# EAGLE design WS2811_Relais (EAGLE 9.5.2)
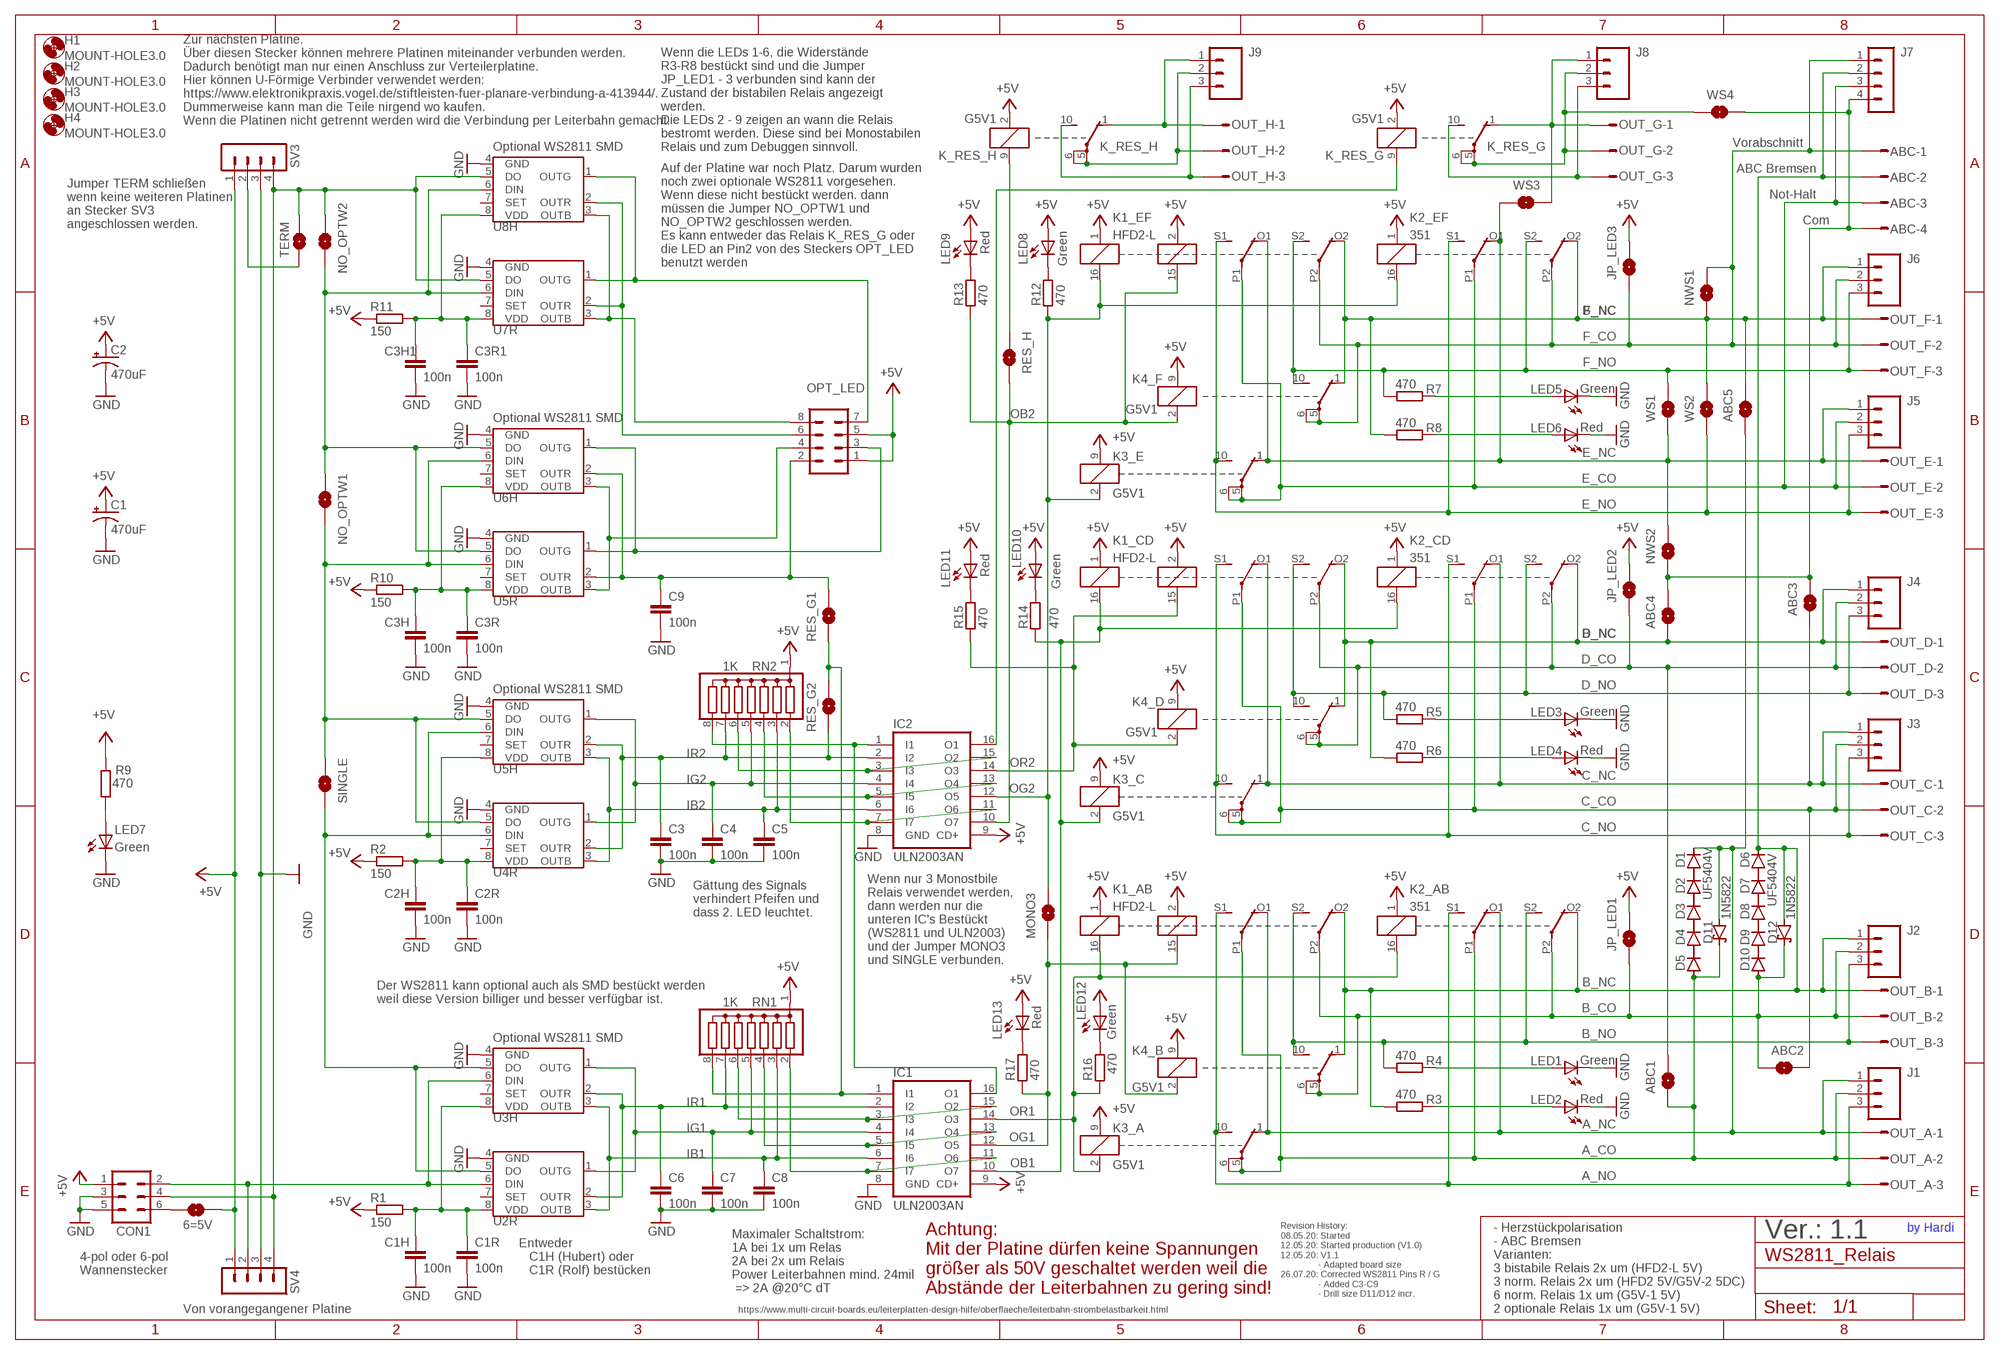
[diagram p0: schematic, sheet 1]

## Parts
6=5V  SOLDERJUMPERNO  [SJ_2S-NO]
ABC  STL1550-4ON_BOARD  [STL1550-4_ON_BOARD]
ABC1  SOLDERJUMPERNO  [SJ_2S-NO]
ABC2  SOLDERJUMPERNO  [SJ_2S-NO]
ABC3  SOLDERJUMPERNO  [SJ_2S-NO]
ABC4  SOLDERJUMPERNO  [SJ_2S-NO]
ABC5  SOLDERJUMPERNO  [SJ_2S-NO]
C1  470uF  SPARKFUN-CAPACITORS_100UF-25V-20%(PTH)  [SPARKFUN-CAPACITORS_CPOL-RADIAL-100UF-25V]
C1H  100n  C-EUC1206  [C1206]
C1R  100n  C-EU025-024X044  [C025-024X044]
C2  470uF  SPARKFUN-CAPACITORS_100UF-25V-20%(PTH)  [SPARKFUN-CAPACITORS_CPOL-RADIAL-100UF-25V]
C2H  100n  C-EUC1206  [C1206]
C2R  100n  C-EU025-024X044  [C025-024X044]
C3  100n  C-EU025-024X044  [C025-024X044]
C3H  100n  C-EUC1206  [C1206]
C3H1  100n  C-EUC1206  [C1206]
C3R  100n  C-EU025-024X044  [C025-024X044]
C3R1  100n  C-EU025-024X044  [C025-024X044]
C4  100n  C-EU025-024X044  [C025-024X044]
C5  100n  C-EU025-024X044  [C025-024X044]
C6  100n  C-EU025-024X044  [C025-024X044]
C7  100n  C-EU025-024X044  [C025-024X044]
C8  100n  C-EU025-024X044  [C025-024X044]
C9  100n  C-EU025-024X044  [C025-024X044]
CON1  ML6  [ML6]
D1  UF5404V  [DO201-15-V]
D2  UF5404V  [DO201-15-V]
D3  UF5404V  [DO201-15-V]
D4  UF5404V  [DO201-15-V]
D5  UF5404V  [DO201-15-V]
D6  UF5404V  [DO201-15-V]
D7  UF5404V  [DO201-15-V]
D8  UF5404V  [DO201-15-V]
D9  UF5404V  [DO201-15-V]
D10  UF5404V  [DO201-15-V]
D11  1N5822  [DO41-7.6]
D12  1N5822  [DO41-7.6]
H1  MOUNT-HOLE3.0  [3,0]
H2  MOUNT-HOLE3.0  [3,0]
H3  MOUNT-HOLE3.0  [3,0]
H4  MOUNT-HOLE3.0  [3,0]
IC1  ULN2003AN  [DIL16]
IC2  ULN2003AN  [DIL16]
J1  M03PTH  [1X03]
J2  M03PTH  [1X03]
J3  M03PTH  [1X03]
J4  M03PTH  [1X03]
J5  M03PTH  [1X03]
J6  M03PTH  [1X03]
J7  MA04-1  [MA04-1]
J8  M03PTH  [1X03]
J9  M03PTH  [1X03]
JP_LED1  SOLDERJUMPERNO  [SJ_2S-NO]
JP_LED2  SOLDERJUMPERNO  [SJ_2S-NO]
JP_LED3  SOLDERJUMPERNO  [SJ_2S-NO]
K1_AB  HFD2-L  [HFD2-L]
K1_CD  HFD2-L  [HFD2-L]
K1_EF  HFD2-L  [HFD2-L]
K2_AB  351  [351]
K2_CD  351  [351]
K2_EF  351  [351]
K3_A  G5V1  [G5V1]
K3_C  G5V1  [G5V1]
K3_E  G5V1  [G5V1]
K4_B  G5V1  [G5V1]
K4_D  G5V1  [G5V1]
K4_F  G5V1  [G5V1]
K_RES_G  G5V1  [G5V1]
K_RES_H  G5V1  [G5V1]
LED1  Green  LED3MM  [LED3MM]
LED2  Red  LED3MM  [LED3MM]
LED3  Green  LED3MM  [LED3MM]
LED4  Red  LED3MM  [LED3MM]
LED5  Green  LED3MM  [LED3MM]
LED6  Red  LED3MM  [LED3MM]
LED7  Green  LED3MM  [LED3MM]
LED8  Green  LED3MM  [LED3MM]
LED9  Red  LED3MM  [LED3MM]
LED10  Green  LED3MM  [LED3MM]
LED11  Red  LED3MM  [LED3MM]
LED12  Green  LED3MM  [LED3MM]
LED13  Red  LED3MM  [LED3MM]
MONO3  SOLDERJUMPERNO  [SJ_2S-NO]
NO_OPTW1  SOLDERJUMPERNO  [SJ_2S-NO]
NO_OPTW2  SOLDERJUMPERNO  [SJ_2S-NO]
NWS1  SOLDERJUMPERNO  [SJ_2S-NO]
NWS2  SOLDERJUMPERNO  [SJ_2S-NO]
OPT_LED  CON-HARTING-ML_ML08  [CON-HARTING-ML_ML08]
OUT_A  STL1550-3  [STL1550-3]
OUT_B  STL1550-3  [STL1550-3]
OUT_C  STL1550-3  [STL1550-3]
OUT_D  STL1550-3  [STL1550-3]
OUT_E  STL1550-3  [STL1550-3]
OUT_F  STL1550-3  [STL1550-3]
OUT_G  STL1550-3  [STL1550-3]
OUT_H  STL1550-3  [STL1550-3]
R1  150  RCL_R-EU_0207/2V  [RCL_0207/2V]
R2  150  RCL_R-EU_0207/2V  [RCL_0207/2V]
R3  470  R0204/2V  [0204/2V]
R4  470  R0204/2V  [0204/2V]
R5  470  R0204/2V  [0204/2V]
R6  470  R0204/2V  [0204/2V]
R7  470  R0204/2V  [0204/2V]
R8  470  R0204/2V  [0204/2V]
R9  470  R0204/2V  [0204/2V]
R10  150  RCL_R-EU_0207/2V  [RCL_0207/2V]
R11  150  RCL_R-EU_0207/2V  [RCL_0207/2V]
R12  470  R0204/2V  [0204/2V]
R13  470  R0204/2V  [0204/2V]
R14  470  R0204/2V  [0204/2V]
R15  470  R0204/2V  [0204/2V]
R16  470  R0204/2V  [0204/2V]
R17  470  R0204/2V  [0204/2V]
RES_G1  SOLDERJUMPERNO  [SJ_2S-NO]
RES_G2  SOLDERJUMPERNO  [SJ_2S-NO]
RES_H  SOLDERJUMPERNO  [SJ_2S-NO]
RN1  1K  G07R  [SIL8]
RN2  1K  G07R  [SIL8]
SINGLE  SOLDERJUMPERNO  [SJ_2S-NO]
SV3  MA04-1  [MA04-1]
SV4  MA04-1  [MA04-1]
TERM  SOLDERJUMPERNO  [SJ_2S-NO]
U2R  TINY45-20-DIP  S3PO_MODUL_WS2811_SOUND_MP3-TF-16P_WS2811_AND_ATTINY_WS2811-ICTINY45-20-DIP  [S3PO_MODUL_WS2811_SOUND_MP3-TF-16P_WS2811_AND_ATTINY_WS2811_DIP08]
U3H  WS2811 SOT-8  S3PO_MODUL_WS2811_SOUND_MP3-TF-16P_WS2811_AND_ATTINY_WS2811-ICSOP8  [SOP8]
U4R  TINY45-20-DIP  S3PO_MODUL_WS2811_SOUND_MP3-TF-16P_WS2811_AND_ATTINY_WS2811-ICTINY45-20-DIP  [S3PO_MODUL_WS2811_SOUND_MP3-TF-16P_WS2811_AND_ATTINY_WS2811_DIP08]
U5H  WS2811 SOT-8  S3PO_MODUL_WS2811_SOUND_MP3-TF-16P_WS2811_AND_ATTINY_WS2811-ICSOP8  [SOP8]
U5R  TINY45-20-DIP  S3PO_MODUL_WS2811_SOUND_MP3-TF-16P_WS2811_AND_ATTINY_WS2811-ICTINY45-20-DIP  [S3PO_MODUL_WS2811_SOUND_MP3-TF-16P_WS2811_AND_ATTINY_WS2811_DIP08]
U6H  WS2811 SOT-8  S3PO_MODUL_WS2811_SOUND_MP3-TF-16P_WS2811_AND_ATTINY_WS2811-ICSOP8  [SOP8]
U7R  TINY45-20-DIP  S3PO_MODUL_WS2811_SOUND_MP3-TF-16P_WS2811_AND_ATTINY_WS2811-ICTINY45-20-DIP  [S3PO_MODUL_WS2811_SOUND_MP3-TF-16P_WS2811_AND_ATTINY_WS2811_DIP08]
U8H  WS2811 SOT-8  S3PO_MODUL_WS2811_SOUND_MP3-TF-16P_WS2811_AND_ATTINY_WS2811-ICSOP8  [SOP8]
WS1  SOLDERJUMPERNO  [SJ_2S-NO]
WS2  SOLDERJUMPERNO  [SJ_2S-NO]
WS3  SOLDERJUMPERNO  [SJ_2S-NO]
WS4  SOLDERJUMPERNO  [SJ_2S-NO]

## Nets
$N100: IC2.7(I7) IC2.11(O6) RN2.2
+5V: 6=5V.2 C1.1(+) C2.1(+) CON1.1 IC1.9(CD+) IC2.9(CD+) JP_LED1.2 JP_LED2.2 JP_LED3.2 K1_AB.1 K1_AB.2 K1_CD.1 K1_CD.2 K1_EF.1 K1_EF.2 K2_AB.1 K2_CD.1 K2_EF.1 K3_A.9 K3_C.9 K3_E.9 K4_B.9 K4_D.9 K4_F.9 K_RES_G.2 K_RES_H.2 LED8.A LED9.A LED10.A LED11.A LED12.A LED13.A OPT_LED.1 OPT_LED.5 R1.1 R2.1 R9.1 R10.1 R11.1 RN1.1 RN2.1 SV3.1 SV4.1
A_CO: ABC1.1 D5.A D11.C J1.2 K1_AB.P1(2:P) K2_AB.P1(2:P) K3_A.5(2:P) K3_A.6(2:P) OUT_A.2
A_NC: ABC5.2 D1.C D11.A J1.1 K1_AB.O1(2:O) K2_AB.O1(2:O) K3_A.1(2:O) OUT_A.1
A_NO: J1.3 K1_AB.S1(2:S) K2_AB.S1(2:S) K3_A.10(2:S) OUT_A.3
B_CO: ABC2.1 D10.A D12.C J2.2 JP_LED1.1 K1_AB.P2(3:P) K2_AB.P2(3:P) K4_B.5(2:P) K4_B.6(2:P) OUT_B.2
B_NC: ABC.2 D6.C D12.A J2.1 J7.2 K1_AB.O2(3:O) K2_AB.O2(3:O) K4_B.1(2:O) OUT_B.1 R3.2
B_NO: J2.3 K1_AB.S2(3:S) K2_AB.S2(3:S) K4_B.10(2:S) OUT_B.3 R4.2
C_CO: ABC2.2 J3.2 K1_CD.P1(2:P) K2_CD.P1(2:P) K3_C.5(2:P) K3_C.6(2:P) OUT_C.2
C_NC: ABC3.2 J3.1 K1_CD.O1(2:O) K2_CD.O1(2:O) K3_C.1(2:O) OUT_C.1
C_NO: J3.3 K1_CD.S1(2:S) K2_CD.S1(2:S) K3_C.10(2:S) OUT_C.3
D_CO: ABC1.2 J4.2 JP_LED2.1 K1_CD.P2(3:P) K2_CD.P2(3:P) K4_D.5(2:P) K4_D.6(2:P) OUT_D.2
D_NC: ABC4.2 J4.1 K1_CD.O2(3:O) K2_CD.O2(3:O) K4_D.1(2:O) OUT_D.1 R6.2
D_NO: J4.3 K1_CD.S2(3:S) K2_CD.S2(3:S) K4_D.10(2:S) OUT_D.3 R5.2
E_CO: ABC.3 J5.2 J7.3 K1_EF.P1(2:P) K2_EF.P1(2:P) K3_E.5(2:P) K3_E.6(2:P) OUT_E.2
E_NC: J5.1 K1_EF.O1(2:O) K2_EF.O1(2:O) K3_E.1(2:O) NWS2.1 OUT_E.1 WS1.2 WS3.2
E_NO: J5.3 K1_EF.S1(2:S) K2_EF.S1(2:S) K3_E.10(2:S) OUT_E.3 WS2.2
F_CO: ABC.1 J6.2 J7.1 JP_LED3.1 K1_EF.P2(3:P) K2_EF.P2(3:P) K4_F.5(2:P) K4_F.6(2:P) NWS1.1 OUT_F.2
F_NC: ABC5.1 J6.1 K1_EF.O2(3:O) K2_EF.O2(3:O) K4_F.1(2:O) NWS1.2 OUT_F.1 R8.2 WS2.1
F_NO: J6.3 K1_EF.S2(3:S) K2_EF.S2(3:S) K4_F.10(2:S) OUT_F.3 R7.2 WS1.1
GND: C1.2(-) C1H.2 C1R.2 C2.2(-) C2H.2 C2R.2 C3.2 C3H1.2 C3H.2 C3R1.2 C3R.2 C4.2 C5.2 C6.2 C7.2 C8.2 C9.2 CON1.3 CON1.5 IC1.8(GND) IC2.8(GND) LED1.K(C) LED2.K(C) LED3.K(C) LED4.K(C) LED5.K(C) LED6.K(C) LED7.K(C) SV3.3 SV4.3 U2R.4(GND) U3H.4(GND) U4R.4(GND) U5H.4(GND) U5R.4(GND) U6H.4(GND) U7R.4(GND) U8H.4(GND)
IB1: C8.1 IC1.6(I6) RN1.3 U2R.3(OUTB) U3H.3(OUTB)
IB2: C5.1 IC2.6(I6) RN2.3 U4R.3(OUTB) U5H.3(OUTB)
IB3: OPT_LED.4 U5R.3(OUTB) U6H.3(OUTB)
IB4: OPT_LED.8 U7R.3(OUTB) U8H.3(OUTB)
IG1: C7.1 IC1.4(I4) RN1.5 U2R.1(OUTG) U3H.1(OUTG)
IG2: C4.1 IC2.4(I4) RN2.5 U4R.1(OUTG) U5H.1(OUTG)
IG3: OPT_LED.3 U5R.1(OUTG) U6H.1(OUTG)
IG4: OPT_LED.7 U7R.1(OUTG) U8H.1(OUTG)
IR1: C6.1 IC1.2(I2) RN1.7 U2R.2(OUTR) U3H.2(OUTR)
IR2: C3.1 IC2.2(I2) RES_G2.2 RN2.7 U4R.2(OUTR) U5H.2(OUTR)
IR3: IC1.1(I1) RES_G1.2 RES_G2.1 RN1.8
IR4: OPT_LED.6 U7R.2(OUTR) U8H.2(OUTR)
N$1: CON1.2 SV4.2 U2R.6(DIN) U3H.6(DIN)
N$2: LED2.A R3.1
N$3: CON1.4 NO_OPTW2.1 SV3.4 SV4.4 TERM.1 U7R.5(DO) U8H.5(DO)
N$4: C1H.1 C1R.1 R1.2 U2R.8(VDD) U3H.8(VDD)
N$5: LED1.A R4.1
N$6: 6=5V.1 CON1.6
N$7: IC1.7(I7) IC1.11(O6) RN1.2
N$8: LED4.A R6.1
N$9: IC1.3(I3) IC1.15(O2) RN1.6
N$10: SV3.2 TERM.2
N$11: IC1.5(I5) IC1.13(O4) RN1.4
N$12: LED3.A R5.1
N$13: C2H.1 C2R.1 R2.2 U4R.8(VDD) U5H.8(VDD)
N$14: LED6.A R8.1
N$15: LED5.A R7.1
N$16: D1.A D2.C
N$17: IC1.16(O1) IC2.1(I1) RN2.8
N$18: IC2.5(I5) IC2.13(O4) RN2.4
N$19: D2.A D3.C
N$20: SINGLE.2 U2R.5(DO) U3H.5(DO) U4R.6(DIN) U5H.6(DIN)
N$21: D3.A D4.C
N$22: LED7.A R9.2
N$23: D4.A D5.C
N$24: D7.A D8.C
N$25: D8.A D9.C
N$26: D9.A D10.C
N$27: D6.A D7.C
N$28: C9.1 OPT_LED.2 RES_G1.1 U5R.2(OUTR) U6H.2(OUTR)
N$29: IC2.3(I3) IC2.15(O2) RN2.6
N$30: J8.2 K_RES_G.5(2:P) K_RES_G.6(2:P) OUT_G.2 WS4.2
N$31: IC2.16(O1) K_RES_G.9
N$32: J8.1 K_RES_G.1(2:O) OUT_G.1 WS3.1
N$33: J8.3 K_RES_G.10(2:S) OUT_G.3
N$34: NO_OPTW1.1 NO_OPTW2.2 U5R.5(DO) U6H.5(DO) U7R.6(DIN) U8H.6(DIN)
N$35: C3H.1 C3R.1 R10.2 U5R.8(VDD) U6H.8(VDD)
N$36: J9.2 K_RES_H.5(2:P) K_RES_H.6(2:P) OUT_H.2
N$37: NO_OPTW1.2 SINGLE.1 U4R.5(DO) U5H.5(DO) U5R.6(DIN) U6H.6(DIN)
N$38: J9.3 K_RES_H.10(2:S) OUT_H.3
N$39: C3H1.1 C3R1.1 R11.2 U7R.8(VDD) U8H.8(VDD)
N$40: J9.1 K_RES_H.1(2:O) OUT_H.1
N$41: K_RES_H.9 RES_H.2
N$42: LED8.K(C) R12.1
N$43: LED9.K(C) R13.1
N$44: LED10.K(C) R14.1
N$45: LED11.K(C) R15.1
N$46: LED12.K(C) R16.1
N$47: LED13.K(C) R17.1
N$49: ABC3.1 ABC4.1 ABC.4 J7.4 NWS2.2 WS4.1
OB1: IC1.10(O7) K1_CD.16 K2_CD.16 K3_C.2 R14.2
OB2: IC2.10(O7) K1_EF.15 K4_F.2 R13.2 RES_H.1
OG1: IC1.12(O5) K1_AB.15 K4_B.2 MONO3.2 R17.2
OG2: IC2.12(O5) K1_EF.16 K2_EF.16 K3_E.2 MONO3.1 R12.2
OR1: IC1.14(O3) K1_AB.16 K2_AB.16 K3_A.2 R16.2
OR2: IC2.14(O3) K1_CD.15 K4_D.2 R15.2
Unconnected: U2R.7(SET) U3H.7(SET) U4R.7(SET) U5H.7(SET) U5R.7(SET) U6H.7(SET) U7R.7(SET) U8H.7(SET)

## Notes on the sheet
- Wenn die LEDs 1-6, die Widerstände
  R3-R8 bestückt sind und die Jumper 
  JP_LED1 - 3 verbunden sind kann der 
  Zustand der bistabilen Relais angezeigt
  werden. 
  Die LEDs 2 - 9 zeigen an wann die Relais
  bestromt werden. Diese sind bei Monostabilen
  Relais und zum Debuggen sinnvoll.
- Zur nächsten Platine. 
  Über diesen Stecker können mehrere Platinen miteinander verbunden werden.
  Dadurch benötigt man nur einen Anschluss zur Verteilerplatine.
  Hier können U-Förmige Verbinder verwendet werden: 
  https://www.elektronikpraxis.vogel.de/stiftleisten-fuer-planare-verbindung-a-413944/.
  Dummerweise kann man die Teile nirgend wo kaufen.
  Wenn die Platinen nicht getrennt werden wird die Verbindung per Leiterbahn gemacht.
- Vorabschnitt
- Optional WS2811 SMD
- ABC Bremsen
- Not-Halt
- Com
- Jumper TERM schließen 
  wenn keine weiteren Platinen
  an Stecker SV3 
  angeschlossen werden.
- Auf der Platine war noch Platz. Darum wurden
  noch zwei optionale WS2811 vorgesehen. 
  Wenn diese nicht bestückt werden. dann 
  müssen die Jumper NO_OPTW1 und 
  NO_OPTW2 geschlossen werden. 
  Es kann entweder das Relais K_RES_G oder 
  die LED an Pin2 von des Steckers OPT_LED 
  benutzt werden
- Optional WS2811 SMD
- Optional WS2811 SMD
- Gättung des Signals
  verhindert Pfeifen und
  dass 2. LED leuchtet.
- Wenn nur 3 Monostbile
  Relais verwendet werden,
  dann werden nur die
  unteren IC's Bestückt
  (WS2811 und ULN2003)
  und der Jumper MONO3
  und SINGLE verbunden.
- Der WS2811 kann optional auch als SMD bestückt werden
  weil diese Version billiger und besser verfügbar ist.
- Optional WS2811 SMD
- Ver.: 1.1
- Achtung:
  Mit der Platine dürfen keine Spannungen
  größer als 50V geschaltet werden weil die
  Abstände der Leiterbahnen zu gering sind!
- Revision History:
  08.05.20: Started
  12.05.20: Started production (V1.0)
  12.05.20: V1.1
                 - Adapted board size
  26.07.20: Corrected WS2811 Pins R / G
                 - Added C3-C9
                 - Drill size D11/D12 incr.
- - Herzstückpolarisation
  - ABC Bremsen
  Varianten:
  3 bistabile Relais 2x um (HFD2-L 5V)
  3 norm. Relais 2x um (HFD2 5V/G5V-2 5DC)
  6 norm. Relais 1x um (G5V-1 5V)
  2 optionale Relais 1x um (G5V-1 5V)
- by Hardi
- Maximaler Schaltstrom:
  1A bei 1x um Relas
  2A bei 2x um Relais
  Power Leiterbahnen mind. 24mil
   => 2A @20°C dT
- 4-pol oder 6-pol 
  Wannenstecker
- Entweder 
     C1H (Hubert) oder 
     C1R (Rolf) bestücken
- https://www.multi-circuit-boards.eu/leiterplatten-design-hilfe/oberflaeche/leiterbahn-strombelastbarkeit.html
- Von vorangegangener Platine

## Library data of the parts
6=5V ABC1-ABC5 JP_LED1-JP_LED3 MONO3 NO_OPTW1 NO_OPTW2 NWS1 NWS2 RES_G1 RES_G2 RES_H SINGLE TERM WS1-WS4 = SparkFun-Retired:SOLDERJUMPER: Solder Jumper Standard SMD solder jumper. Used to automate production. Two varients : Normally Open and Normally Closed are the same, but have different paste layers. NC will have a large amount of paste and should jumper during reflow.
ABC = SchraubStecker3.5:STL1550-4: CONNECTOR Rastermass 3.5 mm Kabel: AK(Z)1550 Platine: STL(Z)1550 Ali: KF2EDG-3.5
C1 C2 = Sound_MP3-TF-16P_and_WS2811:SPARKFUN-CAPACITORS_100UF-25V-20%(PTH): CAP-08439; PROD_ID: CAP-08439
C1H C1R C2H C2R C3 C3H C3H1 C3R C3R1 C4-C9 = rcl:C-EU: CAPACITOR, European symbol; SPICEPREFIX: C
CON1 = con-harting-ml:ML6: HARTING; OC_FARNELL: unknown; OC_NEWARK: unknown
D1-D10 = diode:UF5404: DIODE standard rectifier, 3 A, 50 V (Motorola)
D11 D12 = diode:1N5822: 1.0A SCHOTTKY BARRIER RECTIFIER Source: http://www.diodes.com/datasheets/ds23001.pdf
H1-H4 = holes:MOUNT-HOLE: MOUNTING HOLE with drill center marker
IC1 IC2 = uln-udn:ULN2003A: DRIVER ARRAY; REICHELT: ULN 2003A STM; REICHELT_EU: 0,22 €; REICHELT_LNK: https://www.reichelt.de/seven-darlington-arrays-dip-16-uln-2003a-stm-p216685.html?&trstct=pos_0
J1-J6 J8 J9 = SparkFun-Connectors:M03: Header 3 Standard 3-pin 0.1" header. Use with straight break away headers (SKU : PRT-00116), right angle break away headers (PRT-00553), swiss pins (PRT-00743), machine pins (PRT-00117), and female headers (PRT-00115). Molex polarized connector foot print use with SKU : PRT-08232 with associated crimp pins and housings.
J7 SV3 SV4 = con-lstb:MA04-1: PIN HEADER
K1_AB K1_CD K1_EF = WS2811_Relais:HFD2-L: RELAY 2 x switch, HFD2-L by Hardi; OC_FARNELL: unknown; OC_NEWARK: unknown
K2_AB K2_CD K2_EF = relay:351: RELAY 2 x switch, Omron; OC_FARNELL: unknown; OC_NEWARK: unknown
K3_A K3_C K3_E K4_B K4_D K4_F K_RES_G K_RES_H = relay:G5V1: RELAY 1 x switch, 0.5 A/125 V AC, 1 A/24 V DC , Omron; MPN: G5V-1-DC24; OC_FARNELL: 9949593; OC_NEWARK: 36M6377
LED1-LED13 = Arduino_fuer_LEDs_DCC_2:LED: LED OSRAM: - CHIPLED LG R971, LG N971, LY N971, LG Q971, LY Q971, LO R971, LY R971 LH N974, LH R974 LS Q976, LO Q976, LY Q976 LO Q996 - Hyper CHIPLED LW Q18S LB Q993, LB Q99A, LB R99A - SideLED LS A670, LO A670, LY A670, LG A670, LP A670 LB A673, LV A673, LT A673, LW A673 LH A674 LY A675 LS A676, LA A676, LO A676, LY A676, LW A676 LS A679, LY A679, LG A679 - Hyper Micro SIDELED® LS Y876, LA Y876, LO Y876, LY Y876 LT Y87S - SmartLED LW L88C, LW L88S LB L89C, LB L89S, LG L890 LS L89K, LO L89K, LY L89K LS L896, LA L896, LO L896, LY L896 - TOPLED LS T670, LO T670, LY T670, LG T670, LP T670 LSG T670, LSP T670, LSY T670, LOP T670, LYG T670 LG T671, LOG T671, LSG T671 LB T673, LV T673, LT T673, LW T673 LH T674 LS T676, LA T676, LO T676, LY T676, LB T676, LH T676, LSB T676, LW T676 LB T67C, LV T67C, LT T67C, LS T67K, LO T67K, LY T67K, LW E67C LS E67B, LA E67B, LO E67B, LY E67B, LB E67C, LV E67C, LT E67C LW T67C LS T679, LY T679, LG T679 LS T770, LO T770, LY T770, LG T770, LP T770 LB T773, LV T773, LT T773, LW T773 LH T774 LS E675, LA E675, LY E675, LS T675 LS T776, LA T776, LO T776, LY T776, LB T776 LHGB T686 LT T68C, LB T68C - Hyper Mini TOPLED® LB M676 - Mini TOPLED Santana® LG M470 LS M47K, LO M47K, LY M47K Source: http://www.osram.convergy.de LUXEON: - LUMILED® LXK2-PW12-R00, LXK2-PW12-S00, LXK2-PW14-U00, LXK2-PW14-V00 LXK2-PM12-R00, LXK2-PM12-S00, LXK2-PM14-U00 LXK2-PE12-Q00, LXK2-PE12-R00, LXK2-PE12-S00, LXK2-PE14-T00, LXK2-PE14-U00 LXK2-PB12-K00, LXK2-PB12-L00, LXK2-PB12-M00, LXK2-PB14-N00, LXK2-PB14-P00, LXK2-PB14-Q00 LXK2-PR12-L00, LXK2-PR12-M00, LXK2-PR14-Q00, LXK2-PR14-R00 LXK2-PD12-Q00, LXK2-PD12-R00, LXK2-PD12-S00 LXK2-PH12-R00, LXK2-PH12-S00 LXK2-PL12-P00, LXK2-PL12-Q00, LXK2-PL12-R00 Source: www.luxeon.com KINGBRIGHT: KA-3528ASYC Source: www.kingbright.com
OPT_LED = PushButtonAction_4017_2:CON-HARTING-ML_ML08: Modified by Hardi; OC_FARNELL: unknown; OC_NEWARK: unknown
OUT_A OUT_B OUT_C OUT_D OUT_E OUT_F OUT_G OUT_H = SchraubStecker3.5:STL1550-3: CONNECTOR Rastermass 3.5 mm Kabel: AK(Z)1550 Platine: STL(Z)1550 Ali: KF2EDG-3.5
R1 R2 R10 R11 = Sound_MP3-TF-16P_and_WS2811:RCL_R-EU_: RESISTOR, European symbol; SPICEPREFIX: R
R3-R9 R12-R17 = Arduino_fuer_LEDs_DCC_2:R: RESISTOR, European symbol
RN1 RN2 = resistor-sil:G07R: SIL RESISTOR; OC_FARNELL: unknown; OC_NEWARK: unknown
U2R U4R U5R U7R = S3PO_Modul_WS2811:S3PO_MODUL_WS2811_SOUND_MP3-TF-16P_WS2811_AND_ATTINY_WS2811-IC: Die Pin Nummern für R und G sind getauscht damit sie gleich angesteuert werden wie die WS2812. Der Daten Strom der WS2811 ist RGB, Beim WS2812 ist es aber GRB.; PROD_ID: IC-09439
U3H U5H U6H U8H = S3PO_Modul_WS2811:S3PO_MODUL_WS2811_SOUND_MP3-TF-16P_WS2811_AND_ATTINY_WS2811-IC: Die Pin Nummern für R und G sind getauscht damit sie gleich angesteuert werden wie die WS2812. Der Daten Strom der WS2811 ist RGB, Beim WS2812 ist es aber GRB.

## Board
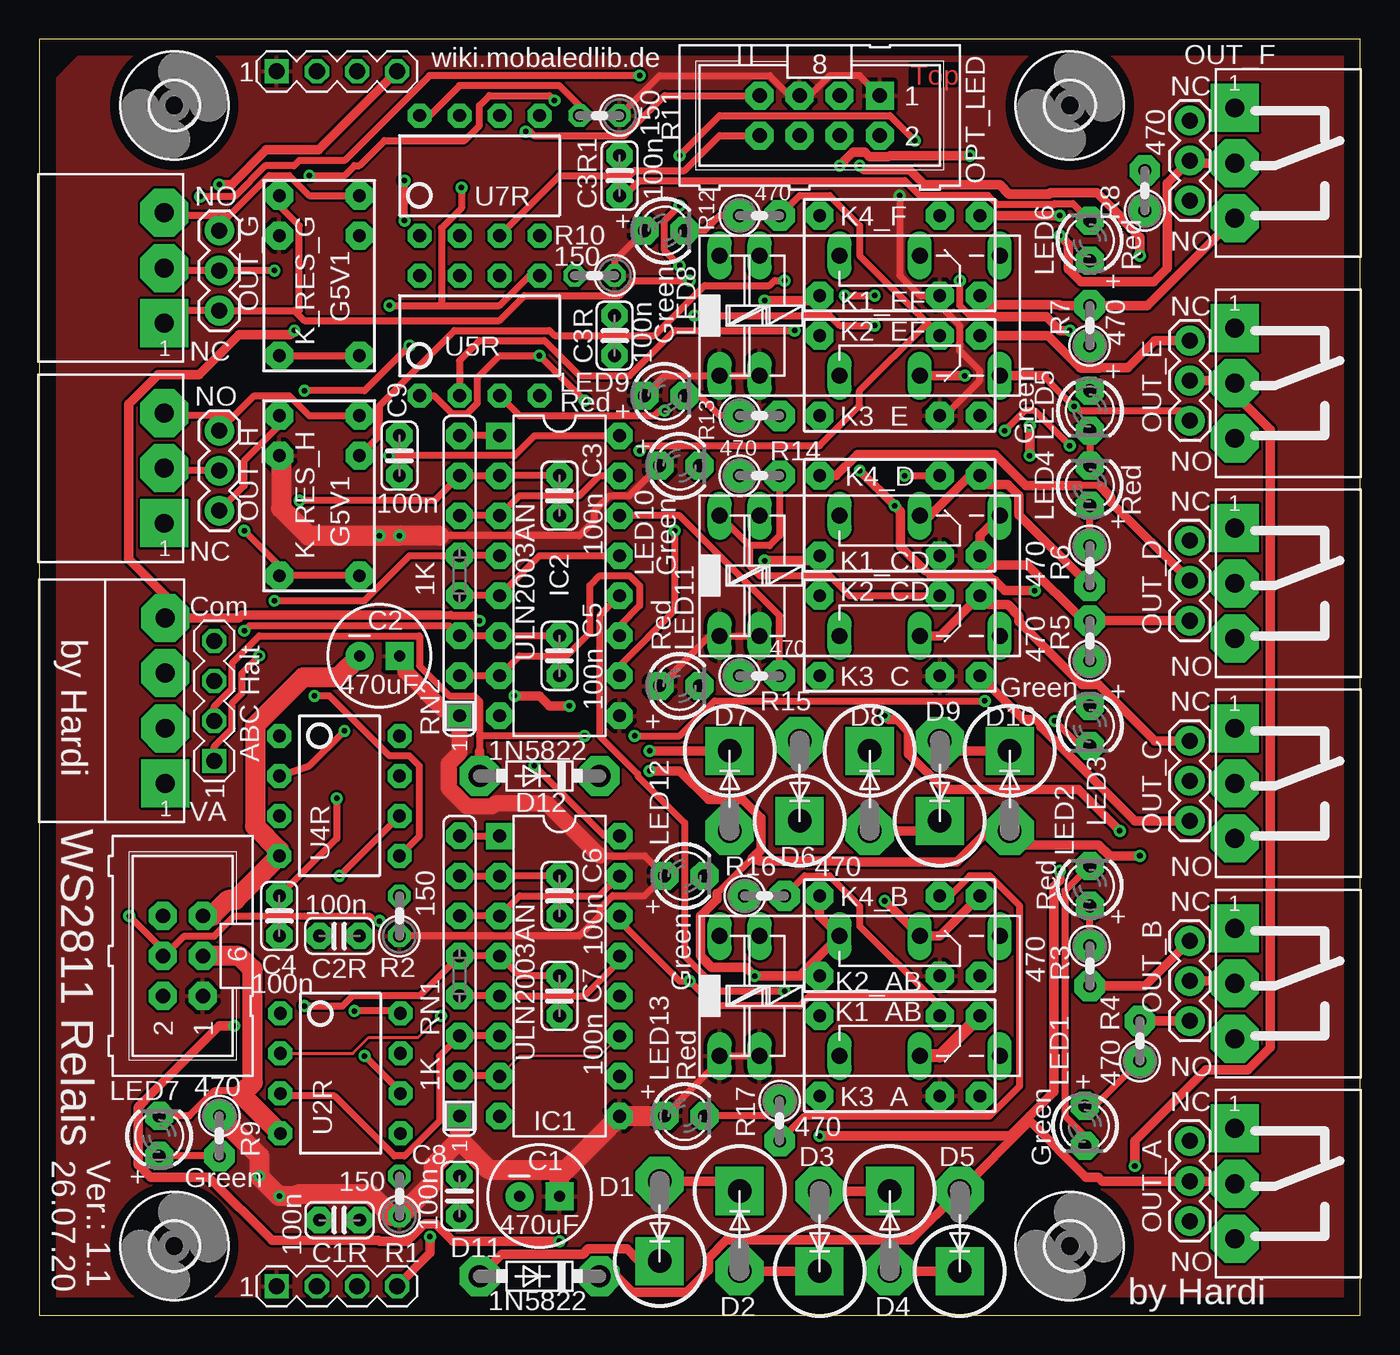
[diagram p1: board, top side]
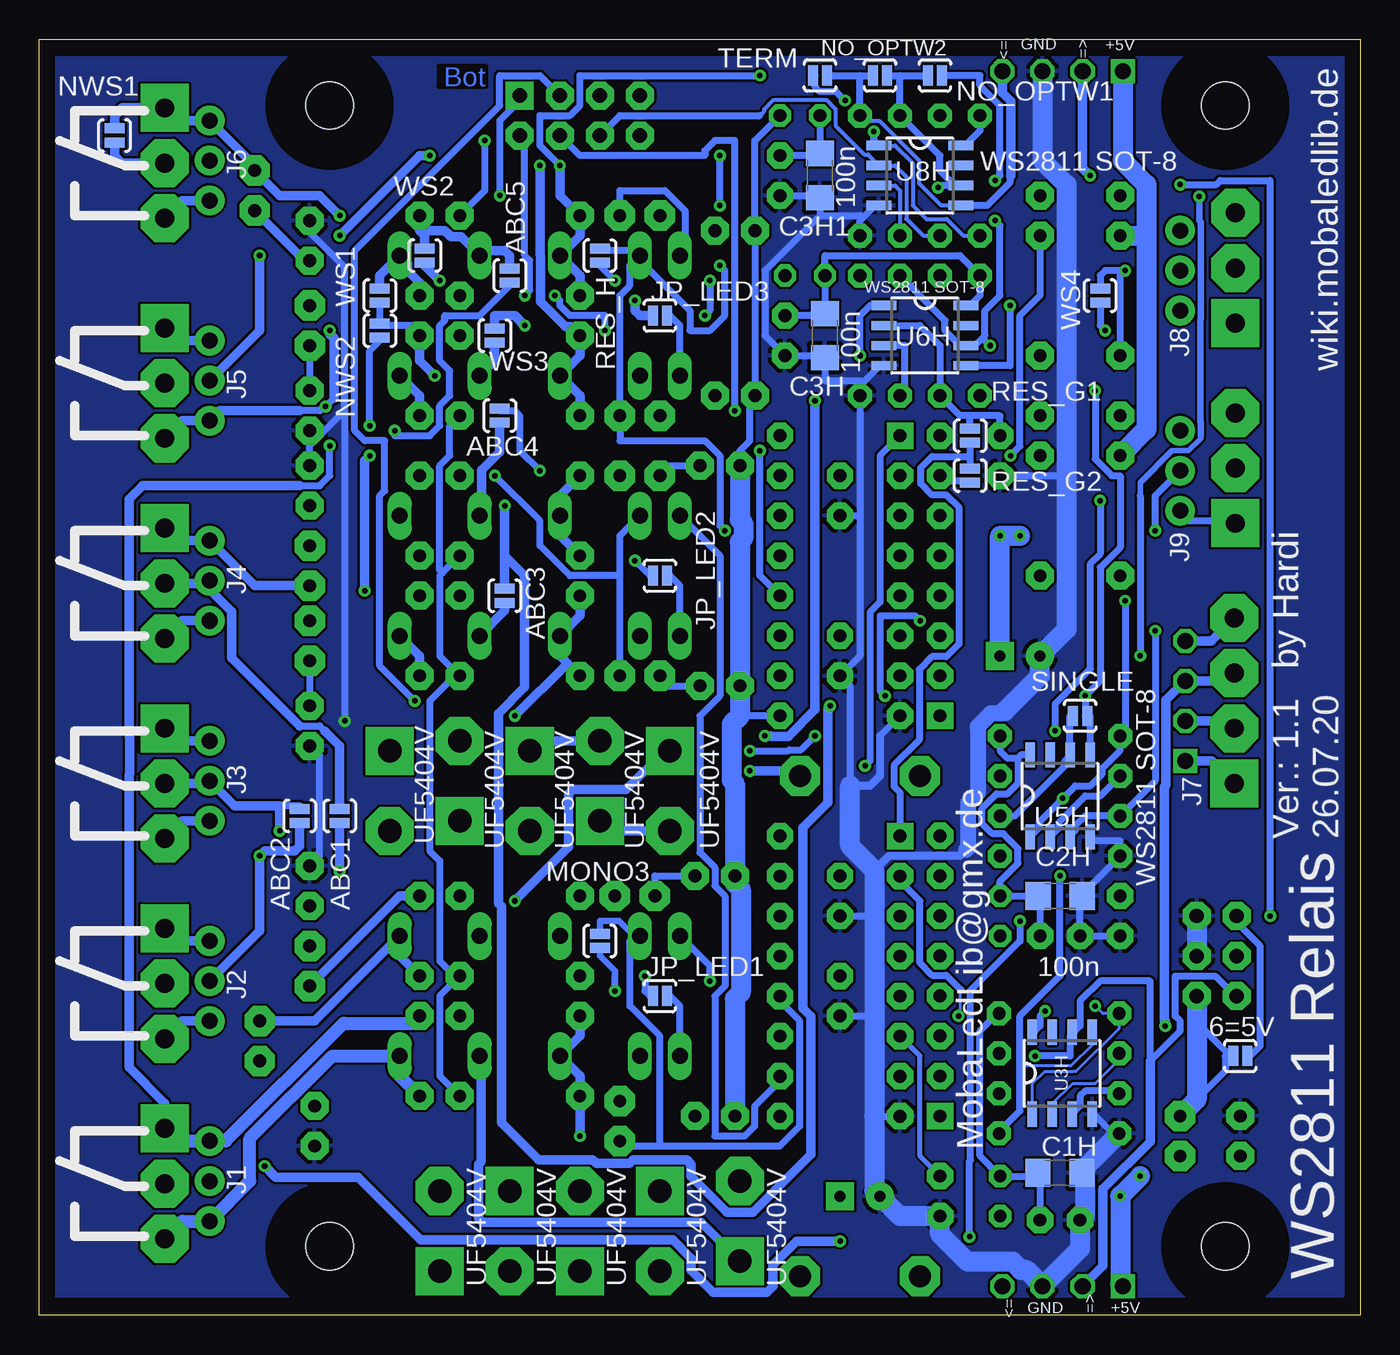
[diagram p2: board, bottom side, seen from below]

Size 83.82 x 80.97 mm. Coordinates in mm from the lower left corner, seen from the top.
Outline: 0,0 83.82,0 83.82,80.97 0,80.97 0,0
Copper layers (1*16): Top 0.035mm / dielectric 1.5mm / Bottom 0.035mm
Design rules "default *": minimum track width 6mil, minimum drill 0.35mm, track to track 6mil, track to pad 6mil, pad to pad 6mil, via to via 6mil, smd to smd 6mil, copper to edge 40mil, drill to drill 6mil, minimum pad ring 10mil, minimum via ring 8mil, stop-mask expansion 4mil, vias tented up to drill 0mil, thermal gap 10mil

### Footprints (pad centres in the part's own frame; a part is rotated, then mirrored left to right if it is on the bottom)
SJ_2S-NO = smd 0.635 x 1.27: 1 -0.45,0; 2 0.45,0
STL1550-4_ON_BOARD = drill 1.2 pad 3.048 square: 1 -1.75,0 | drill 1.2 pad 3.048 octagon: 2 1.75,0; 3 5.25,0; 4 8.75,0
SPARKFUN-CAPACITORS_CPOL-RADIAL-100UF-25V = drill 0.7 pad 1.778 square: 1 1.27,0 | drill 0.7 pad 1.778: 2 -1.27,0
C1206 = smd 1.6 x 1.8: 1 -1.4,0; 2 1.4,0
C025-024X044 = drill 0.813 pad 1.676 octagon: 1 -1.27,0; 2 1.27,0
ML6 = drill 0.914 pad 1.778 octagon: 1 -2.54,-1.27; 2 -2.54,1.27; 3 0,-1.27; 4 0,1.27; 5 2.54,-1.27; 6 2.54,1.27
DO201-15-V = drill 1.499 pad 3.048 octagon: A 5.08,0 | drill 1.499 pad 3.048 square: C 0,0
DO41-7.6 = drill 1.4 pad 2.54 octagon: A 3.81,0; C -3.81,0
3,0 = hole 3: 0,0
DIL16 = drill 0.813 pad 1.676 square: 1 -8.89,-3.81 | drill 0.813 pad 1.676 octagon: 2 -6.35,-3.81; 3 -3.81,-3.81; 4 -1.27,-3.81; 5 1.27,-3.81; 6 3.81,-3.81; 7 6.35,-3.81; 8 8.89,-3.81; 9 8.89,3.81; 10 6.35,3.81; 11 3.81,3.81; 12 1.27,3.81; 13 -1.27,3.81; 14 -3.81,3.81; 15 -6.35,3.81; 16 -8.89,3.81
1X03 = drill 1.016 pad 1.88: 1 0,0; 2 2.54,0; 3 5.08,0
MA04-1 = drill 1.016 pad 1.524 square: 1 -3.81,0 | drill 1.016 pad 1.524 octagon: 2 -1.27,0; 3 1.27,0; 4 3.81,0
HFD2-L = drill 1.016 long: 1 -3.81,-3.81; 2 -1.27,-3.81; 15 -1.27,3.81; 16 -3.81,3.81; O1 8.89,-3.81; O2 8.89,3.81; P1 3.81,-3.81; P2 3.81,3.81; S1 13.97,-3.81; S2 13.97,3.81
351 = drill 1.016 long: 1 -3.81,-3.81; 16 -3.81,3.81; O1 8.89,-3.81; O2 8.89,3.81; P1 3.81,-3.81; P2 3.81,3.81; S1 13.97,-3.81; S2 13.97,3.81
G5V1 = drill 0.813 pad 1.778 octagon: 1 -5.08,-2.54; 2 -2.54,-2.54; 5 5.08,-2.54; 6 5.08,2.54; 9 -2.54,2.54; 10 -5.08,2.54
LED3MM = drill 0.813 pad 1.778 octagon: A -1.27,0; K 1.27,0
CON-HARTING-ML_ML08 = drill 0.914 pad 1.778 square: 1 -5.08,-1.27 | drill 0.914 pad 1.778 octagon: 2 -5.08,1.27; 3 -2.54,-1.27; 4 -2.54,1.27; 5 0,-1.27; 6 0,1.27; 7 2.54,-1.27; 8 2.54,1.27
STL1550-3 = drill 1.2 pad 3.048 square: 1 -1.75,0 | drill 1.2 pad 3.048 octagon: 2 1.75,0; 3 5.25,0
RCL_0207/2V = drill 0.813 pad 1.422 octagon: 1 -1.27,0; 2 1.27,0
0204/2V = drill 0.813 pad 1.93 octagon: 1 -1.27,0; 2 1.27,0
SIL8 = drill 0.813 pad 1.676 square: 1 -8.89,0 | drill 0.813 pad 1.676 octagon: 2 -6.35,0; 3 -3.81,0; 4 -1.27,0; 5 1.27,0; 6 3.81,0; 7 6.35,0; 8 8.89,0
S3PO_MODUL_WS2811_SOUND_MP3-TF-16P_WS2811_AND_ATTINY_WS2811_DIP08 = drill 0.813 pad 1.524 octagon: 1 -3.81,-3.81; 2 -1.27,-3.81; 3 1.27,-3.81; 4 3.81,-3.81; 5 3.81,3.81; 6 1.27,3.81; 7 -1.27,3.81; 8 -3.81,3.81
SOP8 = smd 0.6 x 1.6: 1 -1.905,-2.6; 2 -0.635,-2.6; 3 0.635,-2.6; 4 1.905,-2.6; 5 1.905,2.6; 6 0.635,2.6; 7 -0.635,2.6; 8 -1.905,2.6

### Placement (x,y rotation side)
6=5V  7.61,16.45 180 bottom
ABC  7.99,35.5 90 top
ABC1  64.76,31.68 90 bottom
ABC2  67.3,31.68 90 bottom
ABC3  54.28,45.66 270 bottom
ABC4  54.6,57.09 270 bottom
ABC5  53.96,65.98 270 bottom
C1  31.74,7.55 0 top
C1H  19.05,9.03 0 bottom
C1R  19.05,6.03 180 top
C2  21.58,41.84 0 top
C2H  19.04,26.61 0 bottom
C2R  19.04,24.06 180 top
C3  33.01,52.01 270 top
C3H  33.96,62.16 270 bottom
C3H1  34.28,72.33 270 bottom
C3R  36.5,62.16 270 top
C3R1  36.82,72.33 270 top
C4  15.23,25.33 270 top
C5  33.01,41.84 270 top
C6  33.01,26.61 270 top
C7  33.01,20.25 270 top
C8  26.66,7.55 270 top
C9  22.85,54.55 270 top
CON1  9.1,22.79 90 top
D1  39.36,3.43 90 top
D2  44.44,7.87 270 top
D3  49.52,2.79 90 top
D4  53.96,7.87 270 top
D5  58.41,2.79 90 top
D6  43.8,35.81 270 top
D7  48.25,31.37 90 top
D8  52.7,35.81 270 top
D9  57.14,31.37 90 top
D10  61.58,35.81 270 top
D11  31.74,2.48 180 top
D12  31.74,34.23 180 top
H1  8.56,76.77 0 top
H2  65.39,76.77 0 top
H3  65.39,4.38 0 top
H4  8.56,4.38 0 top
IC1  33.01,21.51 270 top
IC2  33.01,46.93 270 top
J1  73.02,11.05 270 top
J2  73.02,23.75 270 top
J3  73.02,36.45 270 top
J4  73.02,49.15 270 top
J5  73.02,61.85 270 top
J6  73.02,75.82 270 top
J7  11.1,38.99 90 top
J8  11.42,63.75 90 top
J9  11.42,51.05 90 top
JP_LED1  44.44,20.25 0 bottom
JP_LED2  44.44,46.93 0 bottom
JP_LED3  44.44,63.44 0 bottom
K1_AB  46.98,20.25 0 top
K1_CD  46.98,46.93 0 top
K1_EF  46.98,63.44 0 top
K2_AB  46.98,20.25 0 top
K2_CD  46.98,46.93 0 top
K2_EF  46.98,63.44 0 top
K3_A  54.6,16.45 180 top
K3_C  54.6,43.12 180 top
K3_E  54.6,59.62 180 top
K4_B  54.6,24.06 180 top
K4_D  54.6,50.73 180 top
K4_F  54.6,67.25 180 top
K_RES_G  17.77,65.98 270 top
K_RES_H  17.77,52.01 270 top
LED1  66.35,12 270 top
LED2  66.67,27.24 90 top
LED3  66.67,37.4 270 top
LED4  66.67,52.64 90 top
LED5  66.67,57.4 270 top
LED6  66.67,68.2 90 top
LED7  7.61,11.37 90 top
LED8  39.68,68.83 0 top
LED9  39.68,58.36 0 top
LED10  40.63,53.91 0 top
LED11  40.63,39.94 0 top
LED12  40.95,27.88 0 top
LED13  40.95,12.63 0 top
MONO3  48.25,23.75 90 bottom
NO_OPTW1  26.98,78.67 0 bottom
NO_OPTW2  30.47,78.67 0 bottom
NWS1  79.05,74.87 90 bottom
NWS2  62.22,62.48 270 bottom
OPT_LED  48.25,76.14 180 top
OUT_A  75.87,10.1 270 top
OUT_B  75.87,22.79 270 top
OUT_C  75.87,35.5 270 top
OUT_D  75.87,48.2 270 top
OUT_E  75.87,60.9 270 top
OUT_F  75.87,74.87 270 top
OUT_G  7.93,64.7 90 top
OUT_H  7.93,52.01 90 top
R1  22.85,7.55 90 top
R2  22.85,25.33 90 top
R3  66.67,22.16 270 top
R4  69.84,17.4 90 top
R5  66.67,42.8 90 top
R6  66.67,47.56 270 top
R7  66.67,62.8 90 top
R8  70.16,71.37 90 top
R9  11.42,11.37 270 top
R10  35.23,65.98 180 top
R11  35.55,76.14 180 top
R12  45.71,69.78 0 top
R13  45.71,57.09 0 top
R14  45.71,53.28 0 top
R15  45.71,40.58 0 top
R16  46.03,26.61 0 top
R17  46.98,12.32 270 top
RES_G1  24.75,55.82 270 bottom
RES_G2  24.75,53.28 270 bottom
RES_H  48.25,67.25 270 bottom
RN1  26.66,21.52 90 top
RN2  26.66,46.93 90 top
SINGLE  17.77,38.04 180 bottom
SV3  18.88,78.93 0 top
SV4  18.88,1.84 0 top
TERM  34.28,78.67 180 bottom
U2R  19.1,15.33 270 top
U3H  18.91,15.36 0 bottom
U4R  19.04,32.96 270 top
U5H  19.04,32.96 0 bottom
U5R  27.93,62.16 0 top
U6H  27.61,62.16 270 bottom
U7R  27.93,72.33 0 top
U8H  27.93,72.33 270 bottom
WS1  62.22,64.7 270 bottom
WS2  59.36,67.25 270 bottom
WS3  54.92,62.16 270 bottom
WS4  16.5,64.7 90 bottom

### Tracks (layer width: path | path; a pad name or v marks a point on that pad's centre or on a via)
$N100
  Top 0.457: RN2.2 IC2.7 30.47,41.84 33.46,41.84 34.94,43.32 34.94,46.32 35.55,46.93 37.45,46.93 38.09,46.29 38.09,45.02 36.82,43.75 IC2.11
+5V  (via drill 0.35)
  Top 0.457: 43.49,16.45 K1_AB.2 | 43.49,16.45 LED13.A | 43.49,16.45 K2_AB.1 | K1_CD.2 K2_CD.1 42.53,43.12 LED11.A | 35.55,29.14 38.41,29.14 LED12.A 38.41,26.61 36.38,26.61 35.6,25.83 35.6,25.39 34.28,24.06 34.24,24.1 22.89,24.1 R2.1 | K3_E.9 57.46,57.09 59.68,59.31 59.68,59.94 58.41,61.21 58.41,62.8 57.14,64.07 K4_F.9 55.87,64.7 54.6,65.98 v54.6,71.06 | K1_EF.2 K2_EF.1 39.68,59.62 LED9.A | OPT_LED.1 52.06,78.67 50.15,78.67 48.88,77.41 OPT_LED.5 47.61,77.41 46.34,78.67 39.36,78.67 R11.1 | R10.1 36.5,66.93 LED8.A | LED10.A 37.45,52.01 36.18,52.01 35.23,51.05 35.23,50.42 34.28,49.47 25.39,49.47
  Top 1.016: C2.1 23.23,41.46 23.23,40.84 25.66,38.42 26.28,38.42 RN2.1 26.66,35.69 26,35.03 26,33.43 27.13,32.3 28.73,32.3 28.91,32.47 32.22,32.47 35.55,29.14
  Top 1.27: LED13.A 39.66,12.62 IC1.9 33.43,9.23 | R9.1 13.96,10.1 v13.96,8.83 v15.23,7.55 16.3,7.55 16.4,7.66 20.99,7.66 22.36,6.28 R1.1 25.03,8.47 25.03,9.5 26.66,11.12 | K_RES_H.2 15.33,54.44 15.33,51.21 17.07,49.47 v21.58,49.47 v22.85,49.47 25.39,49.47 | RN1.1 26.66,11.12 | 26.66,11.12 28.55,9.23 33.43,9.23 | C1.1 33.01,8.81 33.43,9.23
  Bottom 0.457: 8.4,16.6 10.15,18.35 10.15,20.25 CON1.1 | 8.4,16.6 8.25,16.45 6=5V.2 | R9.1 8.56,15.49 8.56,16.45 8.4,16.6 | K2_AB.1 43.17,19.62 43.8,20.25 JP_LED1.2 | K2_CD.1 43.17,46.29 43.8,46.93 JP_LED2.2 | IC2.9 39.36,38.04 | LED12.A LED13.A | K3_A.9 58.41,15.18 58.41,20.25 K4_B.9 57.46,21.52 58.41,22.48 58.41,28.83 59.04,29.46 59.04,38.99 57.46,40.58 K3_C.9 58.41,41.84 58.41,46.93 58.25,47.08 | K4_D.9 58.25,47.08 | K3_E.9 57.77,56.45 57.77,54.55 58.41,53.91 58.41,47.24 58.25,47.08 | K2_EF.1 43.17,62.8 43.8,63.44 JP_LED3.2 | LED10.A 39.36,54.86 38.72,55.5 38.72,58.04 LED9.A LED8.A 38.41,74.55 R11.1 | v54.6,71.06 54.6,75.82 53.33,77.09 OPT_LED.1
  Bottom 1.27: LED10.A 39.36,50.48 39.15,50.27 39.15,49.3 39.36,49.09 LED11.A 39.36,38.04 39.89,37.5 39.89,33.95 39.68,33.74 LED12.A 39.68,27.41 39.3,27.03 39.3,20.47 39.68,20.09 LED13.A | v15.23,7.55 15.23,2 SV4.1 | CON1.1 10.37,13.68 R9.1 | v13.96,8.83 15.17,7.62 | SV3.1 15.07,73.27 13.55,71.75 13.55,68.52 | K_RES_H.2 13.55,56.22 13.55,68.52 | K_RES_G.2 13.55,68.52 | C2.1 v22.85,49.47 v21.58,49.47
  pour Top: 0.62,78.04 2.53,79.95 83.81,79.95 83.81,1.21 0.62,1.21
A_CO  (via drill 0.35)
  Top 0.457: 62.85,12.32 62.85,12.63
  Top 0.61: v49.52,11.37 61.58,11.37 62.85,12.63 64.39,14.17 64.39,27.21 64.76,27.57 v64.76,28.19 | OUT_A.2 75.71,8.51 J1.2 67.45,8.51 67.2,8.75 66.42,8.75 62.85,12.32 D5.A 55.31,4.77 43.62,4.77 42.46,3.61 42.46,2.83 41.07,1.45 37.65,1.45 36.62,2.48 D11.C
  Bottom 0.61: v49.52,11.37 K3_A.6 49.52,15.18 K1_AB.P1 49.52,17.71 K3_A.5 | ABC1.1 v64.76,28.19
A_NC  (via drill 0.35)
  Top 0.457: v61.27,56.13 62.54,57.4 63.17,57.4 v65.39,55.18
  Top 0.61: D1.C 38.06,3.43 37.28,4.2 34.84,4.2 34.49,3.86 29.32,3.86 D11.A
  Top 0.813: K3_A.1 57.14,16.45 K1_AB.O1
  Bottom 0.457: v61.27,56.13 61.27,55.82 59.04,55.82 58.41,56.45 58.41,57.72 57.77,58.36 57.77,59.94 58.41,60.58 58.41,62.8 58.09,63.12 58.09,63.44 55.87,63.44 53.96,65.34 ABC5.2 | v65.39,55.18 65.39,53.28 66.03,52.64 67.3,52.64
  Bottom 0.61: OUT_A.1 75.87,13.46 78.13,15.71 78.13,34.31 78.09,34.34 78.09,36.65 78.13,36.68 78.13,51.78 77.27,52.64 67.3,52.64 | D1.C 41.82,5.89 55.68,5.89 55.95,6.16 55.95,9.59 55.79,9.74 55.79,16.37 K1_AB.O1
  Bottom 0.813: OUT_A.1 75.08,11.05 J1.1 71.98,11.05 64.5,18.53 60.14,18.53 K3_A.1
A_NO
  Bottom 0.813: OUT_A.3 74.75,5.97 J1.3 70.46,8.52 70.46,11.21 65.22,16.45 K1_AB.S1 60.95,15.18 K3_A.10
B_CO  (via drill 0.35)
  Top 0.457: K4_B.6 48.25,21.52 | 43.01,26.76 45.23,28.99 45.39,28.83 45.71,28.83
  Top 0.61: OUT_B.2 75.71,21.21 J2.2 | v69.84,29.14 67.93,29.14 67.22,29.86 62.46,29.86 D10.A 60.2,30.73 58.22,28.75 51.87,28.75 51.8,28.83 45.71,28.83 | v38.72,34.54 40.63,34.54 42.46,32.71 44.63,32.71 45.79,31.55 45.79,29.54 45.23,28.99 | 43.01,26.76 43.01,26.39 41.95,25.33 41.95,22.8 42.66,22.08 44.83,22.08 v45.39,21.52 48.25,21.52 | 48.25,21.52 K2_AB.P2 49.52,25.33 K4_B.5 | K4_B.6 48.25,21.52
  Bottom 0.457: v45.39,21.52 45.39,20.57 45.07,20.25 JP_LED1.1
  Bottom 0.61: ABC2.1 67.3,29.78 67.62,29.46 69.52,29.46 v69.84,29.14 69.84,24.38 J2.2 | D12.C 35.87,34.54 v38.72,34.54
B_NC  (via drill 0.35)
  Top 0.457: 27.93,36.77 27.93,38.99 27.61,39.3 26.03,39.3 24.12,41.21 24.12,43.12 13.96,43.12 12.25,41.4 12.25,39.78 11.1,38.64 J7.2 | 27.93,36.77 27.93,35.81 | v34.6,36.77 27.93,36.77
  Top 0.61: J2.1 70.16,20.89 R3.2 | K4_B.1 57.14,24.06 K2_AB.O2 v53.65,26.29 | D6.C v38.72,35.81 | D12.A 27.93,35.81
  Bottom 0.457: v38.72,35.81 36.3,35.81 36.23,35.88 35.49,35.88 v34.6,36.77
  Bottom 0.61: OUT_B.1 75.08,23.75 J2.1 | R3.2 60.95,26.61 K4_B.1 | D6.C 44.12,35.81 46.59,33.35 49.96,33.35 50.23,33.08 50.23,29.7 v53.65,26.29 | ABC.2 8.46,37.72 J7.2
B_NO
  Top 0.61: J2.3 R4.2
  Bottom 0.61: OUT_B.3 74.75,18.67 J2.3 | R4.2 66.35,18.67 K2_AB.S2 60.95,22.79 K4_B.10
C_CO  (via drill 0.35)
  Top 0.61: v68.57,30.73 65.95,33.35 57.44,33.35 55.16,35.63 55.16,37.04 54.41,37.79 53.89,37.79 v53.65,38.04
  Bottom 0.457: 50.31,41.37 50.47,41.53 | 68.57,32.32 67.3,32.32 ABC2.2
  Bottom 0.61: OUT_C.2 73.18,33.75 J3.2 71.43,32.32 68.57,32.32 v68.57,30.73 | v53.65,38.04 50.31,41.37 K3_C.6 | 50.47,41.53 50.79,41.84 K1_CD.P1 49.52,44.39 K3_C.5
C_NC
  Top 0.61: K1_CD.O1 57.14,43.12 K3_C.1 60.24,45.1 61.45,45.1 62.17,44.38 62.17,44.01 66.17,40.02 67.22,40.02 70.79,36.45 J3.1
  Bottom 0.61: OUT_C.1 75.08,36.45 J3.1 | K1_CD.O1 54.28,44.7 ABC3.2
C_NO
  Top 0.61: K3_C.10 62.46,37.79 63.3,37.79 63.57,37.53 63.57,37.33 69.52,31.37 J3.3
  Bottom 0.61: OUT_C.3 74.75,31.37 J3.3 | K3_C.10 59.68,41.84 K1_CD.S1
D_CO  (via drill 0.35)
  Top 0.457: 67.3,52.64 66.03,52.64
  Top 0.61: J4.2 68.01,51.61 68.01,51.93 67.3,52.64 | 66.03,52.64 62.61,52.64 60.63,54.62 51.91,54.62 50.56,53.28 K4_D.5 | K4_D.6 49.2,47.88 v46.03,47.88
  Bottom 0.457: v46.03,47.88 45.07,46.93 JP_LED2.1 | 65.71,37.08 66.03,37.4 67.3,37.4
  Bottom 0.61: OUT_D.2 73.18,46.45 J4.2 73.02,46.04 71.62,44.65 71.62,41.72 67.3,37.4 | ABC1.2 64.76,36.13 65.71,37.08 | K4_D.5 50.79,52.01 K2_CD.P2 50.79,49.47 K4_D.6
D_NC
  Top 0.457: 56.5,50.73 K2_CD.O2
  Top 0.61: R6.2 62.17,50.79 62.17,52 61.45,52.72 60.24,52.72 K4_D.1 59.04,53.28 56.5,50.73
  Bottom 0.61: OUT_D.1 75.08,49.15 J4.1 70.16,46.29 R6.2 | K2_CD.O2 55.75,50.85 55.75,53.62 54.6,54.77 ABC4.2
D_NO
  Top 0.61: J4.3 R5.2 66.26,44.07 62.72,47.61 60.26,47.61 K4_D.10 59.68,49.47 K2_CD.S2
  Bottom 0.61: OUT_D.3 74.75,44.07 J4.3
E_CO  (via drill 0.35)
  Top 0.457: 11.42,18.35 6.66,13.59 6.34,13.27 6.34,9.46 6.97,8.83 10.79,8.83 14.91,4.7 21.58,4.7 | 26.63,4.7 26.66,4.7
  Top 0.61: J5.2 75.71,59.31 OUT_E.2 75.87,58.46 78.13,56.21 78.13,16.98 78.11,16.98 76.69,15.56 74.04,15.56 69.52,11.05 v69.52,9.46 | v52.06,72.96 52.33,72.69 55.2,72.69 56.15,71.74 60.95,71.74 61.53,71.16 64.09,71.16 64.16,71.23 67.12,71.23 68.73,69.62 68.73,69.51 69.84,68.41 v69.84,67.25 | 6.66,13.59 6.26,13.19 6.26,9.54 7.05,8.75 10.75,8.75 14.77,4.74 21.54,4.74 | 6.34,13.27 11.42,18.35 v12.37,18.35 | 21.58,4.7 23.33,4.7 24.45,5.81 25.14,5.81 26.25,4.7 26.63,4.7 | 26.66,4.7 v33.01,4.7
  Bottom 0.61: v52.06,72.96 52.06,67.26 52.01,67.21 52.01,64.32 50.44,62.75 50.1,62.75 K3_E.5 49.52,60.9 K1_EF.P1 49.52,58.36 K3_E.6 | v12.37,18.35 12.37,18.65 12.42,18.7 12.42,33.52 12.32,33.62 12.32,39.04 J7.3 8.48,40.26 ABC.3 | v69.52,9.46 68.81,8.75 63.58,8.75 59.61,4.77 43.62,4.77 42.46,3.61 42.46,2.83 41.07,1.45 37.65,1.45 37.28,1.82 37.28,3.19 35.77,4.7 v33.01,4.7 | v69.84,67.25 69.84,62.48 J5.2
E_NC  (via drill 0.35)
  Top 0.61: K3_E.1 64.02,62.16 66.08,60.11 67.3,60.11 67.33,60.14 69.09,60.14 70.79,61.85 J5.1 | v58.73,59.62 K1_EF.O1
  Bottom 0.457: WS1.2 NWS2.1 62.22,62.8 59.68,62.8 K3_E.1
  Bottom 0.61: OUT_E.1 75.08,61.85 J5.1 | K3_E.1 59.68,60.58 v58.73,59.62 | K1_EF.O1 54.92,60.58 WS3.2
E_NO  (via drill 0.35)
  Top 0.457: v58.41,65.66 58.41,64.07 59.04,63.44 60.56,63.44 60.63,63.36 | J5.3 72.38,57.4 66.03,57.4 65.76,57.67 v65.66,57.67 64.23,59.1 64.16,59.17 63.79,59.54 63.79,59.62
  Top 0.61: 63.79,59.62 K1_EF.S1 | v65.39,62.48 64.78,62.48 63.9,63.36 60.63,63.36
  Bottom 0.457: 58.57,65.82 v58.41,65.66 | 67.3,57.4 66.03,57.4 65.76,57.67 v65.66,57.67 65.13,58.2
  Bottom 0.61: OUT_E.3 74.75,56.77 J5.3 72.38,57.4 67.3,57.4 | v65.39,62.48 65.39,62.27 65.13,62.01 65.13,58.2 | WS2.2 59.36,66.61 58.57,65.82 | K3_E.10 59.68,58.36 K1_EF.S1
F_CO  (via drill 0.35)
  Top 0.457: 51.11,73.28 v50.79,72.96 | v38.09,78.67 34.28,78.67 24.75,78.67 19.36,73.28 16.5,73.28 16.16,72.94 14.34,72.94 12.4,70.99 v10.21,70.99 | v13.96,41.84 12.86,40.74 12.86,39.47 12.25,38.86 12.25,37.24 11.1,36.1 J7.1
  Top 0.61: OUT_F.2 73.18,73.12 J6.2 71.58,71.84 71.58,66.45 70.72,65.58 66.11,65.58 65.32,66.37 65.32,67.96 v64.76,68.52 | v59.04,73.59 53.96,73.59 53.89,73.52 52.68,73.52 52.41,73.8 51.62,73.8 51.11,73.28 | K4_F.6 49.2,64.39 v46.03,64.39
  Bottom 0.356: 10.12,55.82 10.12,55.63 10.89,54.86 11.95,54.86 13.96,52.85 13.96,52.01
  Bottom 0.406: v10.21,70.99 10.21,69.45 10.12,69.37 10.12,63.22 10.15,63.19 10.15,56.69 10.12,56.67 10.12,55.82
  Bottom 0.457: 13.96,52.01 v13.96,41.84 | v38.09,78.67 49.52,78.67 49.52,76.77 50.15,76.14 52.06,76.14 52.06,74.23 v50.79,72.96
  Bottom 0.61: NWS1.1 79.05,73.59 78.57,73.12 OUT_F.2 | v50.79,72.96 50.79,71.06 K4_F.5 49.52,68.52 K2_EF.P2 49.52,65.98 K4_F.6 | JP_LED3.1 45.71,63.44 46.03,63.75 v46.03,64.39 | ABC.1 9.42,35.18 J7.1 | v64.76,68.52 59.68,73.59 v59.04,73.59
F_NC  (via drill 0.35)
  Top 0.61: v64.76,69.78 K4_F.1
  Bottom 0.457: K4_F.1 59.68,68.83
  Bottom 0.61: WS2.1 59.36,68.52 59.68,68.83 58.09,68.83 57.7,68.44 57.06,68.44 K2_EF.O2 55.55,67.56 54.28,67.56 53.96,67.25 ABC5.1 | NWS1.2 79.05,76.14 78.57,76.62 OUT_F.1 75.08,75.82 J6.1 70.16,72.96 R8.2 68.57,71.06 66.03,71.06 v64.76,69.78
F_NO
  Top 0.457: R7.2 60.31,64.07 K4_F.10
  Top 0.61: K4_F.10 60.26,64.12 64.73,64.12 64.78,64.07 R7.2 70.33,64.07 OUT_F.3
  Bottom 0.61: OUT_F.3 74.75,70.74 J6.3 | K4_F.10 59.68,65.51 60.45,66.29 60.45,66.75 K2_EF.S2 62.22,65.98 WS1.1
GND  (via drill 0.35)
  Top 0.457: LED1.K 66.35,11.37 65.08,12.63 65.08,26.92 LED2.K | LED5.K LED4.K | C3R1.2 37.14,71.06 38.09,72.01 54.92,72.01 55.87,71.06 60.21,71.06 60.79,70.47 64.37,70.47 64.45,70.54 65.59,70.54 LED6.K | LED3.K 66.03,36.13 v64.44,37.72 | LED7.K 9.52,12.63 11.1,14.22 12.69,14.22 12.85,14.06 13.01,14.22
  Top 1.27: C2.2 18.94,40.47 16.74,40.47 13.68,37.41 13.68,31.04 15.23,29.49 U4R.4 12.44,26.35 11.95,26.35 10.94,25.33 CON1.5 | U2R.4 12.85,13.97 12.85,14.06 | 13.01,14.22 13.54,14.75 13.54,21.95 12.69,22.79 CON1.3
  Bottom 0.457: LED3.K 66.03,35.5 66.03,29.14 LED2.K | 64.6,57.24 66.67,55.18 LED4.K | 64.6,57.24 64.44,57.4 64.44,66.5 66.67,68.72 LED6.K | 31.58,59.15 31.74,58.99 U5R.4 31.74,50.73 | 31.58,59.15 30.47,60.26 U6H.4 | 31.58,59.15 31.74,59.31 33.96,59.31 C3H.2 33.96,60.9 C3R.2 37.77,62.16 37.77,66.29 34.28,69.78 | 31.58,69.63 31.74,69.47 U7R.4 | 31.58,69.63 30.79,70.42 U8H.4 | C3R1.2 34.28,71.06 C3H1.2 34.28,69.78 | 34.28,69.78 31.74,69.78 31.58,69.63 | v64.44,37.72 64.44,57.09 64.6,57.24 | IC2.8 30.47,36.77 | U3H.4 16.82,12.63 15.55,11.37 U2R.4 | C1R.2 17.77,6.28 17.77,8.83 C1H.2 17.45,9.14 | U5H.4 17.14,30.1 15.23,30.1 U4R.4 17.45,26.92 17.45,26.61 C2H.2 17.77,26.61 C2R.2 C4.2 | 30.83,12.63 30.81,12.62 IC1.8 | 31.74,50.73 31.74,41.84 C5.2 32.38,39.94 32.38,33.59 | C3.2 31.74,50.73 | C7.2 30.83,18.98 | C6.2 30.83,25.33 | C9.2 18.63,53.28
  Bottom 0.508: 30.83,28.23 29.9,29.16 25.38,29.16 25.01,29.53 | 30.47,36.77 30.47,34.23 31.11,33.59 32.38,33.59
  Bottom 1.016: 22.57,38.31 22.7,38.19 23.44,38.19 24.27,37.35 24.27,33.14 24.88,32.53 24.88,29.65 25.01,29.53
  Bottom 1.27: SV3.3 20.15,73.27 18.63,71.75 18.63,53.28 18.63,43.52 C2.2 20.31,40.58 22.57,38.31 | 32.38,33.59 32.38,29.78 30.83,28.23 30.83,25.33 30.83,18.98 30.83,12.63 30.83,7.91 C1.2 29.2,6.28 C8.2 26.66,5.13 24.92,3.39 22.05,3.39 21.53,2.87 21.18,2.87 SV4.3 17.78,4.21 C1R.2 17.45,6.35 17.45,9.14 17.45,9.37 U2R.4 | CON1.5 CON1.3
  pour Bottom: 0.62,79.95 83.81,79.95 83.81,1.21 0.62,1.21
IB1
  Top 0.457: IC1.6 RN1.3 25.39,16.45 25.39,12.32 23.17,10.1 22.53,10.1 18.72,13.91 15.55,13.91 U2R.3
  Bottom 0.305: C8.1 27.93,10.1 27.93,16.45 29.19,17.7 IC1.6
  Bottom 0.457: U3H.3 18.09,12.95 17.77,13.27 17.77,13.91 17.45,14.22 15.55,14.22 U2R.3
IB2  (via drill 0.35)
  Top 0.457: v13.01,43.43 13.32,43.75 26.03,43.75 RN2.3 IC2.6 C5.1
  Bottom 0.457: U5H.3 18.41,30.41 18.09,30.73 18.09,31.05 17.45,31.68 U4R.3 13.01,33.91 v13.01,43.43
IB3  (via drill 0.35)
  Top 0.457: v39.68,57.4 39.36,57.4 39.04,57.09 30.47,57.09 U5R.3
  Bottom 0.457: U6H.3 28.88,61.53 28.88,58.67 U5R.3 | OPT_LED.4 49.52,73.59 41.58,73.59 41.58,73.91 40.95,74.55 39.68,74.55 v39.68,57.4
IB4
  Top 0.457: OPT_LED.8 43.17,74.87 40.95,72.64 37.77,72.64 37.45,72.33 33.01,72.33 U7R.3
  Bottom 0.254: U8H.3 29.52,71.69 29.2,71.37 U7R.3
IG1  (via drill 0.35)
  Top 0.457: IC1.4 RN1.5 24.15,20.29 19.9,20.29 19.24,19.62 v16.82,19.62 | IC1.4 | C7.1 30.47,21.52 IC1.4
  Bottom 0.203: v16.82,19.62 16.34,19.14 U2R.1 15.29,18.21 18.05,15.46 18.21,15.46 18.21,15.45 20.03,15.45 20.82,14.67 U3H.1
IG2  (via drill 0.35)
  Top 0.457: IC2.4 RN2.5 23.48,48.2 20.63,45.34 v14.91,45.34 | v18.88,32.79 18.88,30.25 C4.1
  Bottom 0.457: v14.91,45.34 14.91,37.08 U4R.1 15.23,35.84 16.37,34.7 16.37,34.35 17.14,33.59 18.08,33.59 v18.88,32.79 20.36,31.31 20.36,30.94 U5H.1
IG3  (via drill 0.35)
  Top 0.457: v60,38.99 42.85,38.99 40.63,36.77 v37.77,36.77 | v34.6,58.04 v31.74,60.9 29.2,60.9 27.8,59.5 27.8,57.88 27.13,57.21 26.19,57.21 25.04,58.36 U5R.1
  Bottom 0.457: OPT_LED.3 52.06,78.67 54.6,78.67 54.6,76.77 63.81,67.56 63.81,56.13 63.17,55.5 61.9,55.5 61.9,52.32 62.22,52.01 62.22,41.21 v60,38.99 | v31.74,60.9 31.74,63.44 31.11,64.07 U6H.1
  Bottom 0.61: v37.77,36.77 37.38,36.77 37.36,36.74 36.28,36.74 34.6,38.43 v34.6,58.04
IG4  (via drill 0.35)
  Top 0.457: OPT_LED.7 39.68,77.41 37.14,74.87 31.39,74.87 31.15,75.11 v30.86,75.11
  Bottom 0.254: U8H.1 29.52,74.23 28.39,73.1 28.39,70.42 27.52,69.56 26.23,69.56 25.19,68.52 U7R.1
  Bottom 0.457: U8H.1 30.86,74.56 v30.86,75.11
IR1  (via drill 0.35)
  Top 0.203: U2R.2 19.89,16.6 20.91,17.62 24.03,17.62 25.39,18.98 v25.49,18.98
  Top 0.457: RN1.7 IC1.2 | IC1.2 | C6.1 IC1.2
  Bottom 0.203: U3H.2 19.55,13.4 18.24,14.71 16.82,14.71 15.29,16.23 U2R.2 | v25.49,18.98 25.37,19.11 25.37,20.68
  Bottom 0.457: IC1.2 29.2,27.56 27.93,26.29 27.93,22.34 27.16,21.58 26.26,21.58 25.37,20.68
IR2  (via drill 0.35)
  Top 0.457: U4R.2 17.14,34.86 v19.36,37.08 | v16.5,51.69 25.07,51.69 RN2.7 IC2.2 C3.1
  Bottom 0.457: RN2.7 26.66,52.96 24.75,52.96 RES_G2.2 | v16.5,51.69 16.5,48.31 17.11,47.7 17.11,41.03 19.36,38.78 v19.36,37.08 | U5H.2 19.09,30.94 19.09,31.31 17.44,32.96 16.5,32.96 U4R.2
IR3
  Top 0.457: RN1.8 IC1.1
  Bottom 0.457: RES_G1.2 24.75,54.55 | 24.75,54.55 RES_G2.1 | 24.75,54.55 24.81,54.49 27.16,54.49 27.88,53.78 27.88,52.77 27.16,52.06 26.26,52.06 25.44,51.24 25.44,42.61 26.26,41.79 27.16,41.79 27.98,40.98 27.98,36.51 29.58,34.91 29.58,33.54 29.2,33.16 IC1.1
IR4
  Bottom 0.254: 38.09,76.14 37.81,76.41 37.81,76.55 37.23,77.13 33.87,77.13 33.29,76.55 33.29,75.49 31.45,73.65 31.22,73.65 U8H.2 29.52,72.96 28.79,72.24 28.79,69.56 28.77,69.56 27.73,68.52 U7R.2
  Bottom 0.457: OPT_LED.6 46.98,76.14 38.09,76.14
N$1  (via drill 0.35)
  Top 0.457: v20.63,16.45 22.85,14.22 U2R.6
  Bottom 0.457: v20.63,16.45 18.41,16.45 18.41,17.71 U3H.6 18.09,18.03 17.77,18.35 17.77,19.94 16.5,21.21 13.32,21.21 13.32,16.13 11.42,18.03 11.42,18.67 11.74,18.98 11.74,21.52 9.2,21.52 7.93,20.25 CON1.2
  Bottom 0.61: SV4.2 16.32,3.13 16.32,8.01 13.32,11.01 13.32,16.13
N$2
  Top 0.457: R3.1 LED2.A
N$3  (via drill 0.35)
  Top 0.457: v21.58,25.02 21.26,25.02 20.95,25.33 12.37,25.33 11.1,24.06 9.2,24.06 7.93,22.79 CON1.4 7.93,23.11 v5.71,25.33
  Top 0.61: SV3.4 17.73,73.96 14.4,73.96 12.19,71.75 v11.42,71.75 | SV4.4 24.79,3.94 v24.79,4.98
  Bottom 0.254: U7R.5 31.37,75.77 30.48,75.77 27.98,73.27 27.98,71.81 26.59,70.42 U8H.5
  Bottom 0.457: TERM.1 31.74,78.67 | 31.74,78.67 NO_OPTW2.1 | U7R.5 31.74,78.67 | v21.58,25.02 21.58,23.75 24.75,20.57 24.73,20.55 24.73,9.84 24.79,9.78 v24.79,4.98 | v5.71,25.33 5.71,72.01 8.88,72.01 9.13,71.75 v11.42,71.75 | 22.16,72.33 22.24,72.25 22.24,71.86 23.68,70.42 U8H.5
  Bottom 0.61: SV3.4 22.69,77.58 22.16,77.05 22.16,72.33
N$4  (via drill 0.35)
  Top 0.457: v19.99,19.3 22.85,19.3 U2R.8
  Bottom 0.457: v19.99,19.3 20.31,18.98 20.31,18.35 20.63,18.03 U3H.8 | C1R.1 20.31,6.28 20.31,8.83 C1H.1 20.63,8.83 R1.2 24.12,10.1 24.12,18.03 23.17,18.98 U2R.8
N$5
  Top 0.457: LED1.A 66.98,13.27 R4.1
N$6
  Bottom 0.457: 6=5V.1 6.97,16.45 6.34,17.08 6.34,23.43 7.61,24.7 7.61,25.33 CON1.6
N$7
  Top 0.152: IC1.7 30.48,16.45 35.56,16.45 IC1.11
  Top 0.457: RN1.2 IC1.7
N$8
  Top 0.457: R6.1 LED4.A
N$9
  Top 0.457: RN1.6 IC1.3 30.48,26.61 35.52,26.61 36.13,27.21 36.17,27.21 IC1.15
N$10  (via drill 0.35)
  Top 0.457: v32.69,77.09 32.38,77.41 28.57,77.41 27.93,76.77 27.93,75.5 26.98,74.55 21.9,74.55 20.31,72.96 19.99,72.96 19.36,72.33 v17.14,72.33
  Bottom 0.457: TERM.2 34.6,78.67 34.6,77.95 34.3,77.66 33.26,77.66 v32.69,77.09
  Bottom 0.61: SV3.2 17.61,72.8 v17.14,72.33
N$11
  Top 0.457: RN1.4 IC1.5 29.21,20.25 34.6,20.25 36.82,22.48 IC1.13
N$12
  Bottom 0.457: R5.1 LED3.A
N$13
  Bottom 0.457: U4R.8 22.85,35.81 22.41,35.37 21.71,35.37 | C2R.1 20.31,26.61 C2H.1 R2.2 22.85,27.53 21.71,28.67 21.71,29.62 22.63,30.54 23.32,30.54 23.99,31.21 23.99,32.16 23.07,33.08 22.38,33.08 21.71,33.75 21.71,35.37 | U5H.8 21.52,35.55 21.71,35.37
N$14
  Bottom 0.61: LED6.A 66.98,66.93 R8.1
N$15
  Bottom 0.457: R7.1 LED5.A
N$16
  Top 0.61: D1.A 43.8,8.51 D2.C
N$17  (via drill 0.35)
  Top 0.457: v31.42,34.86 35.87,30.41 IC1.16 | IC2.1 RN2.8
  Bottom 0.457: v31.42,34.86 31.11,35.18 31.11,44.61 30.47,45.25 30.47,54.55 IC2.1
N$18
  Top 0.457: RN2.4 IC2.5 31.74,48.2 IC2.13
N$19
  Top 0.61: D2.A D3.C
N$20  (via drill 0.35)
  Top 0.457: v19.04,27.88 U4R.6
  Bottom 0.203: 21.58,15.81 18.36,15.81 17.01,17.16 U3H.5
  Bottom 0.457: SINGLE.2 18.41,38.04 U5H.6 18.41,35.5 18.72,35.18 18.72,34.86 21.9,31.68 U4R.6 | U2R.5 22.85,11.68 21.58,12.95 21.58,15.81 21.58,18.98 19.04,21.52 v19.04,27.88
N$21
  Top 0.61: D4.C D3.A
N$22
  Top 0.457: R9.2 LED7.A
N$23
  Top 0.61: D4.A D5.C
N$24
  Bottom 0.61: D7.A 52.06,36.45 D8.C
N$25
  Top 0.61: D9.C 56.5,30.73 D8.A
N$26
  Top 0.61: D10.C 57.77,35.81 D9.A
N$27
  Bottom 0.61: D7.C 47.61,30.73 D6.A
N$28  (via drill 0.35)
  Top 0.457: v51.11,64.7 v53.01,64.7 | v47.93,62.48 40.31,62.48 37.45,59.62 34.28,59.62 32.06,61.85 27.93,61.85 26.66,60.58 U5R.2
  Bottom 0.457: OPT_LED.2 53.01,74.55 53.01,67.25 52.7,66.93 52.7,65.02 v53.01,64.7 | v51.11,64.7 50.79,64.39 50.79,64.07 50.15,63.44 47.93,63.44 v47.93,62.48 | C9.1 22.85,57.09 24.75,57.09 | 24.75,57.09 25.39,57.09 U5R.2 26.66,61.53 27.93,62.8 U6H.2 | RES_G1.1 24.75,57.09
N$29
  Top 0.457: RN2.6 IC2.3 30.47,52.01 34.28,52.01 35.55,53.28 IC2.15
N$30  (via drill 0.35)
  Top 0.457: OUT_G.2 7.93,66.29 J8.2 v14.91,66.29 | K_RES_G.5 K_RES_G.6
  Bottom 0.457: K_RES_G.5 15.23,65.98 v14.91,66.29 16.18,66.29 16.5,65.98 WS4.2
N$31  (via drill 0.35)
  Top 0.457: IC2.16 31.42,55.82 30.31,54.7 30.15,54.55 v22.18,54.55
  Bottom 0.457: K_RES_G.9 20.31,64.7 21.58,63.44 21.58,55.15 v22.18,54.55
N$32  (via drill 0.35)
  Top 0.457: v53.01,62.8 50.79,62.8 50.15,63.44 v41.58,63.44 | v41.27,65.66 37.77,65.66 36.82,64.7 30.79,64.7 29.2,63.12 16.82,63.12 16.34,63.59 | 16.34,63.59 16.18,63.75 J8.1 8.72,63.75 OUT_G.1 | K_RES_G.1 15.23,70.42 16.5,69.15 16.5,63.75 16.34,63.59
  Bottom 0.457: v41.58,63.44 41.27,63.75 v41.27,65.66
  Bottom 0.61: WS3.1 54.92,63.42 54.91,63.43 53.64,63.43 v53.01,62.8
N$33
  Top 0.457: K_RES_G.10 17.14,71.06 15.86,72.33 14.59,72.33 11.9,69.63 | 11.9,69.63 11.42,69.15 J8.3 | OUT_G.3 7.93,69.78 11.74,69.78 11.9,69.63
N$34  (via drill 0.35)
  Top 0.457: U5R.5 31.11,65.98 29.2,64.07 25.39,64.07 | v22.21,64.07 25.39,64.07 | v26.79,71.56 26.79,70.27 25.52,68.99 25.52,64.2 25.39,64.07
  Bottom 0.457: NO_OPTW2.2 29.2,78.67 | 29.2,78.67 NO_OPTW1.1 | 29.2,78.67 U7R.6 26.66,73.59 26.66,72.64 25.71,71.69 U8H.6 26.66,71.69 v26.79,71.56 | U6H.5 22.21,60.26 v22.21,64.07
N$35
  Bottom 0.457: U6H.8 24.75,64.07 24.12,64.7 U5R.8 25.39,67.25 33.96,67.25 R10.2 C3H.1 33.96,63.44 C3R.1
N$36  (via drill 0.35)
  Top 0.457: J9.2 7.93,53.59 OUT_H.2 | K_RES_H.6 15.86,46.93 | 15.86,46.93 v13.01,49.78 | 15.86,46.93 K_RES_H.5
  Bottom 0.457: J9.2 13.01,52.01 v13.01,49.78
N$37  (via drill 0.35)
  Top 0.457: v17.45,39.3 18.41,39.3 22.21,35.5 23.48,35.5 24.12,34.86 24.12,30.41 U4R.5 | v23.17,69.47 v23.17,72.01 | v16.82,58.67 20.63,58.67 v23.48,61.53
  Bottom 0.457: U5H.5 17.14,38.04 SINGLE.1 17.45,38.04 v17.45,39.3 16.5,40.26 16.5,47.45 15.23,48.72 15.23,53.28 15.76,53.28 16.82,54.34 v16.82,58.67 | NO_OPTW1.2 24.12,78.67 24.12,78.04 22.85,76.77 22.85,72.33 v23.17,72.01 | v23.17,69.47 22.85,69.15 22.85,64.7 23.8,63.75 23.8,62.16 23.96,62.01 | 23.96,62.01 24.44,61.53 U6H.6 25.39,61.53 26.34,62.48 26.34,63.12 U5R.6 | 23.96,62.01 v23.48,61.53
N$38
  Top 0.457: K_RES_H.10 17.14,57.09 15.86,58.36 13.64,58.36 12.21,56.93 | J9.3 12.21,56.93 | OUT_H.3 7.93,57.09 12.05,57.09 12.21,56.93
N$39
  Top 0.457: U7R.8 24.75,76.14 26.66,78.04 33.01,78.04 34.28,76.77 R11.2
  Bottom 0.457: U7R.8 24.12,75.18 25.07,74.23 U8H.8 | R11.2 C3H1.1 34.28,73.59 C3R1.1
N$40
  Top 0.457: K_RES_H.1 15.23,56.45 13.01,54.23 13.01,52.64 J9.1
  Bottom 0.457: J9.1 11.42,50.42 7.93,50.42 OUT_H.1
N$41  (via drill 0.35)
  Top 0.457: v47.3,65.66 46.66,65.66 46.34,65.34 42.22,65.34 39.04,62.16 32.69,62.16 32.38,62.48 26.34,62.48 21.58,57.72 21.58,55.82 K_RES_H.9
  Bottom 0.457: v47.3,65.66 48.25,66.61 RES_H.2
N$42
  Top 0.457: LED8.K 42.22,68.83 43.17,69.78 R12.1
N$43
  Top 0.457: LED9.K 41.9,58.36 43.17,57.09 R13.1
N$44
  Bottom 0.457: LED10.K 44.44,53.91 R14.1
N$45
  Bottom 0.457: LED11.K 44.44,39.94 R15.1
N$46
  Bottom 0.457: LED12.K 44.76,27.88 R16.1
N$47
  Top 0.457: LED13.K 46.03,12.63 R17.1
N$49  (via drill 0.35)
  Top 0.457: 60.63,46.61 60.31,46.93 56.5,46.93 56.19,47.24
  Top 0.508: 25.39,44.44 26.12,44.44 26.14,44.41 27.59,44.41 v27.93,44.07
  Top 0.61: v52.06,53.59 v54.28,51.37 54.65,51 54.65,48.78 56.19,47.24 | v62.85,54.55 v62.85,56.45 | v63.17,45.97 61.27,45.97 60.63,46.61 | 25.39,44.44 12.83,44.44 12.64,44.25 ABC.4 7.99,45.66 5.67,47.98 5.67,57.82 7.54,59.69 10.14,59.69 12.69,62.24 15.94,62.24 v16.18,62.48 | v30.15,39.3 31.74,39.3 32.38,38.67 v33.64,38.67
  Bottom 0.457: v52.06,53.59 53.33,54.86 53.33,57.09 53.65,57.4 54.6,57.4 ABC4.1 | v62.85,56.45 62.85,61.21 62.22,61.85 NWS2.2 | v30.15,39.3 30.47,39.62 30.47,44.39 28.25,44.39 v27.93,44.07 | WS4.1 16.5,62.8 v16.18,62.48
  Bottom 0.61: ABC3.1 54.28,48.2 | 54.28,48.2 v54.28,51.37 | v63.17,45.97 63.17,54.23 v62.85,54.55 | ABC.4 9.44,42.8 J7.4 | v33.64,38.67 33.76,38.55 33.76,32.55 35.37,30.94 35.37,19.46 34.86,18.95 34.86,10.2 38.54,6.53 40.18,6.53 42.46,8.8 42.46,9.59 42.73,9.85 46.15,9.85 46.38,9.62 48.47,9.62 48.7,9.85 52.14,9.85 54.48,12.2 54.48,25.94 54.68,26.13 54.68,38.19 53.01,39.85 53.01,46.93 54.28,48.2
OB1
  Top 0.457: 45.07,48.83 K2_CD.16 | 45.07,48.83 46.34,48.83 46.98,49.47 R14.2 | K3_C.2 51.42,45.66 50.15,46.93 45.71,46.93 45.07,47.56 45.07,48.83
  Bottom 0.457: K2_CD.16 40.63,48.2 40.63,39.3 41.9,38.04 41.9,29.35 40.95,28.4 40.95,27.24 40.31,26.61 40.31,20.89 40.95,20.25 40.95,11.37 39.04,11.37 38.41,12 38.41,13.27 36.82,14.86 IC1.10
OB2  (via drill 0.35)
  Top 0.457: IC2.10 36.82,41.21 40.31,44.7 v40.31,49.78 | v55.55,74.55 53.96,76.14 43.17,76.14 v40.63,73.59 | v40.63,70.42 39.68,69.47 39.68,67.56 v40.63,66.61
  Bottom 0.457: K1_EF.15 45.71,67.56 48.25,67.56 RES_H.1 | v40.31,49.78 40.63,50.1 40.63,54.55 41.58,55.5 46.98,55.5 R13.2 46.98,64.7 46.34,65.34 46.34,66.61 K1_EF.15 | K4_F.2 55.55,71.37 v55.55,74.55 | v40.63,70.42 v40.63,73.59 | v40.63,66.61 40.31,66.29 40.31,63.44 41.27,62.48 42.53,62.48 42.53,63.75 45.71,66.93 K1_EF.15
OG1
  Top 0.457: K4_B.2 57.77,26.61 59.04,27.88 60.31,27.88 62.22,25.97 62.22,14.54 60.31,12.63 48.57,12.63 R17.2
  Bottom 0.406: MONO3.2 48.25,25.02 47.04,25.02 45.96,23.94
  Bottom 0.457: 46.34,23.75 45.71,23.75 K1_AB.15 45.96,23.94 46.34,23.75 | 44.44,10.73 46.98,10.73 R17.2 | 44.44,10.73 36.82,10.73 35.55,12 35.55,18.67 36.82,19.94 IC1.12 | 46.34,23.75 46.34,19.62 44.44,17.71 44.44,10.73
OG2  (via drill 0.35)
  Top 0.457: 56.35,62.96 52.06,67.25 52.06,69.15 50.15,71.06 48.25,71.06 R12.2 | 56.35,62.96 K3_E.2 | v47.3,20.57 43.17,20.57 40.95,22.79 40.95,31.25 37.97,34.23 37.97,34.35 35.55,36.77 35.55,44.39 IC2.12 | 56.35,62.96 52.06,58.67 52.06,57.72 49.52,55.18 38.41,55.18 v38.09,54.86
  Bottom 0.406: MONO3.1 48.25,22.79 47.3,21.84 47.3,21.52
  Bottom 0.457: K1_EF.16 42.85,67.56 42.85,70.1 44.12,71.37 46.98,71.37 R12.2 | v47.3,20.57 47.3,21.52 | v38.09,54.86 38.09,46.93 IC2.12
OR1  (via drill 0.35)
  Top 0.457: IC1.14 36.82,25.02 40.63,21.21 v41.27,21.21 42.85,19.62 48.25,19.62 48.88,20.25 56.19,20.25 56.35,20.41 | K3_A.2 57.14,19.62 56.35,20.41 | 56.35,20.41 52.06,24.7 52.06,25.97 50.15,27.88 48.57,27.88 R16.2
  Bottom 0.457: K1_AB.16 41.27,22.16 v41.27,21.21
OR2  (via drill 0.35)
  Top 0.457: IC2.14 40.63,50.73 46.98,44.39 R15.2 | v54.92,53.28 K4_D.2
  Bottom 0.457: K1_CD.15 46.98,49.47 46.98,46.93 | R15.2 46.98,46.93 | v54.92,53.28 52.06,50.42 52.06,48.83 50.15,46.93 46.98,46.93

### Text on the board
Top: Top
Bottom: Bot
tNames: wiki.mobaledlib.de | NC | NO | + | NO | + | NC | NC | + | NO | + | + | NO | NC | + | NC | Com | by Hardi | NO | Halt | + | NC | + | WS2811 Relais | VA | NO | NC | + | + | NO | + | + | NC | 26.07.20 | Ver.: 1.1 | + | NO | by Hardi
bNames: => | <= | +5V | GND | wiki.mobaledlib.de | by Hardi | MobaLedLib@gmx.de | 26.07.20 | Ver.: 1.1 | WS2811 Relais | <= | +5V | => | GND